# Altium project BOOSTXL-DRV8301.PrjPcb (part 1 of 2)
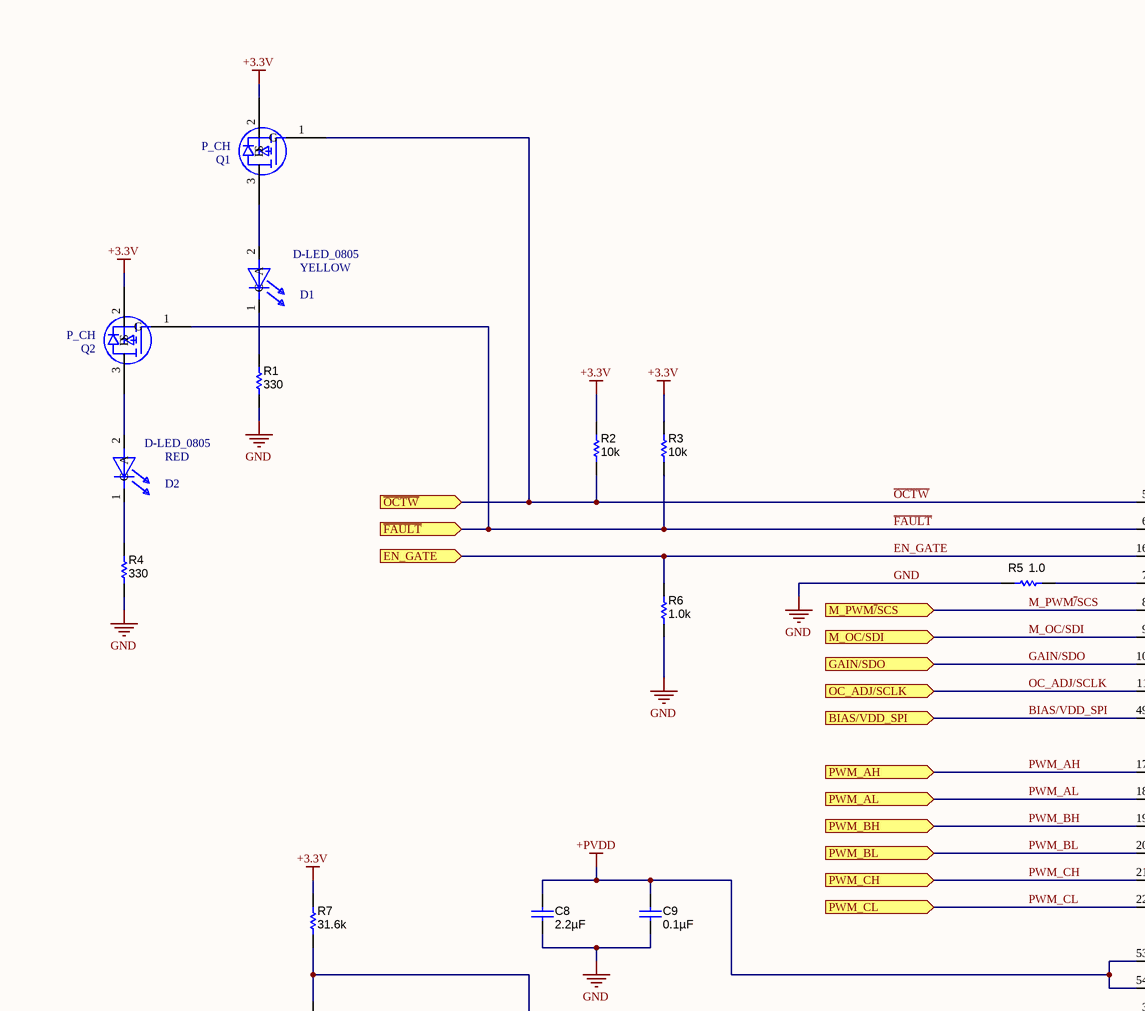
[diagram p0: DRV8301.SchDoc, top left]
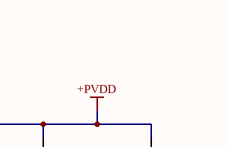
[diagram p1: DRV8301.SchDoc, top right]
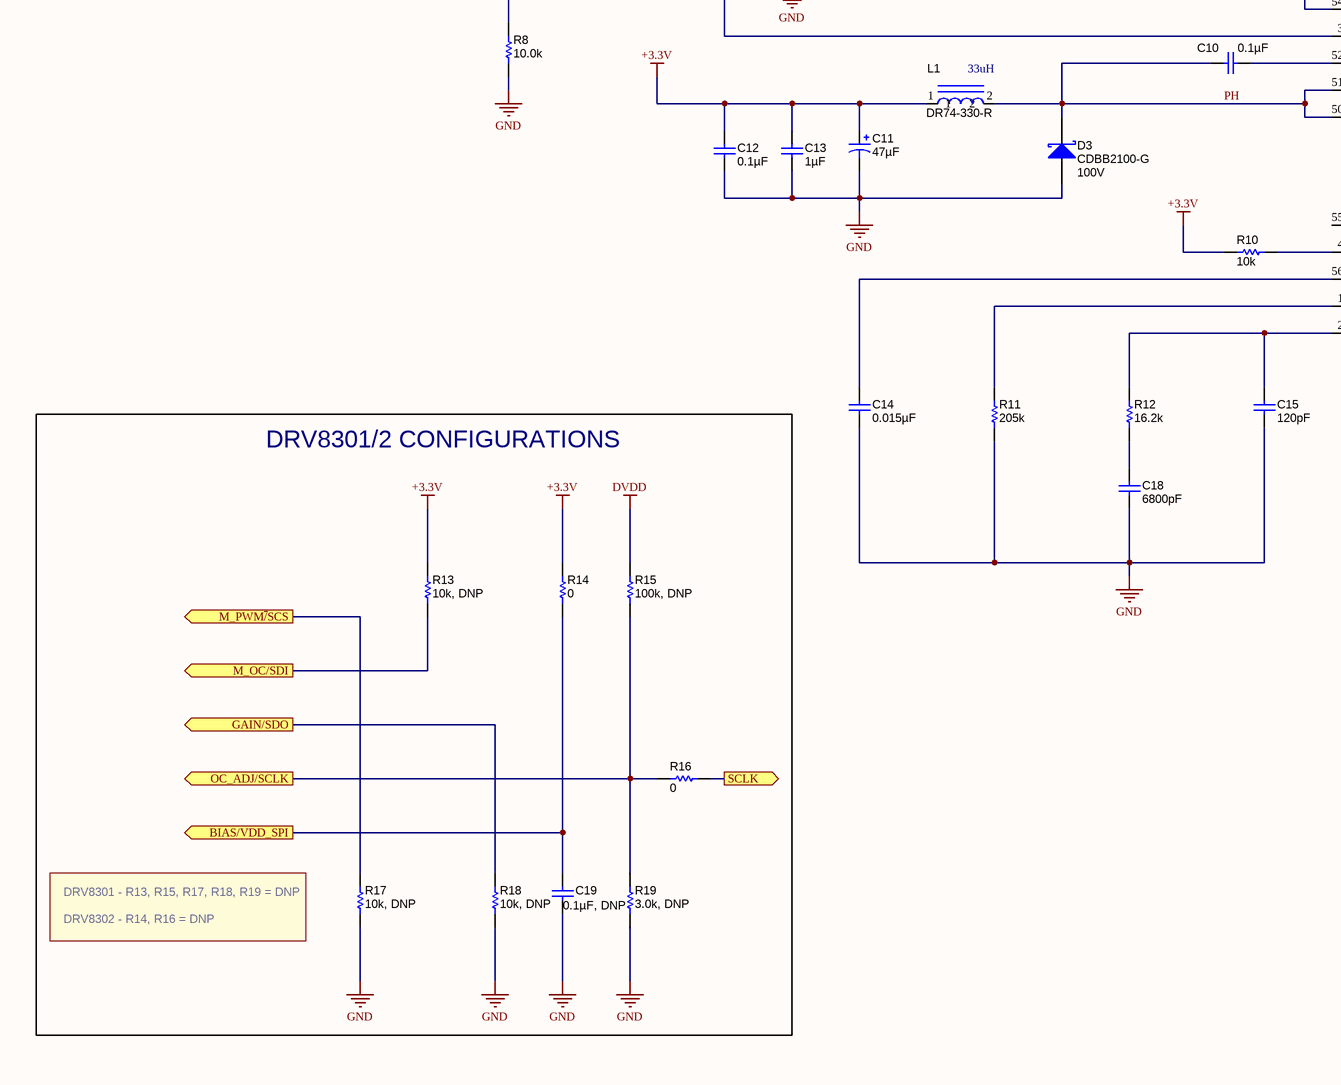
[diagram p2: DRV8301.SchDoc, bottom left]
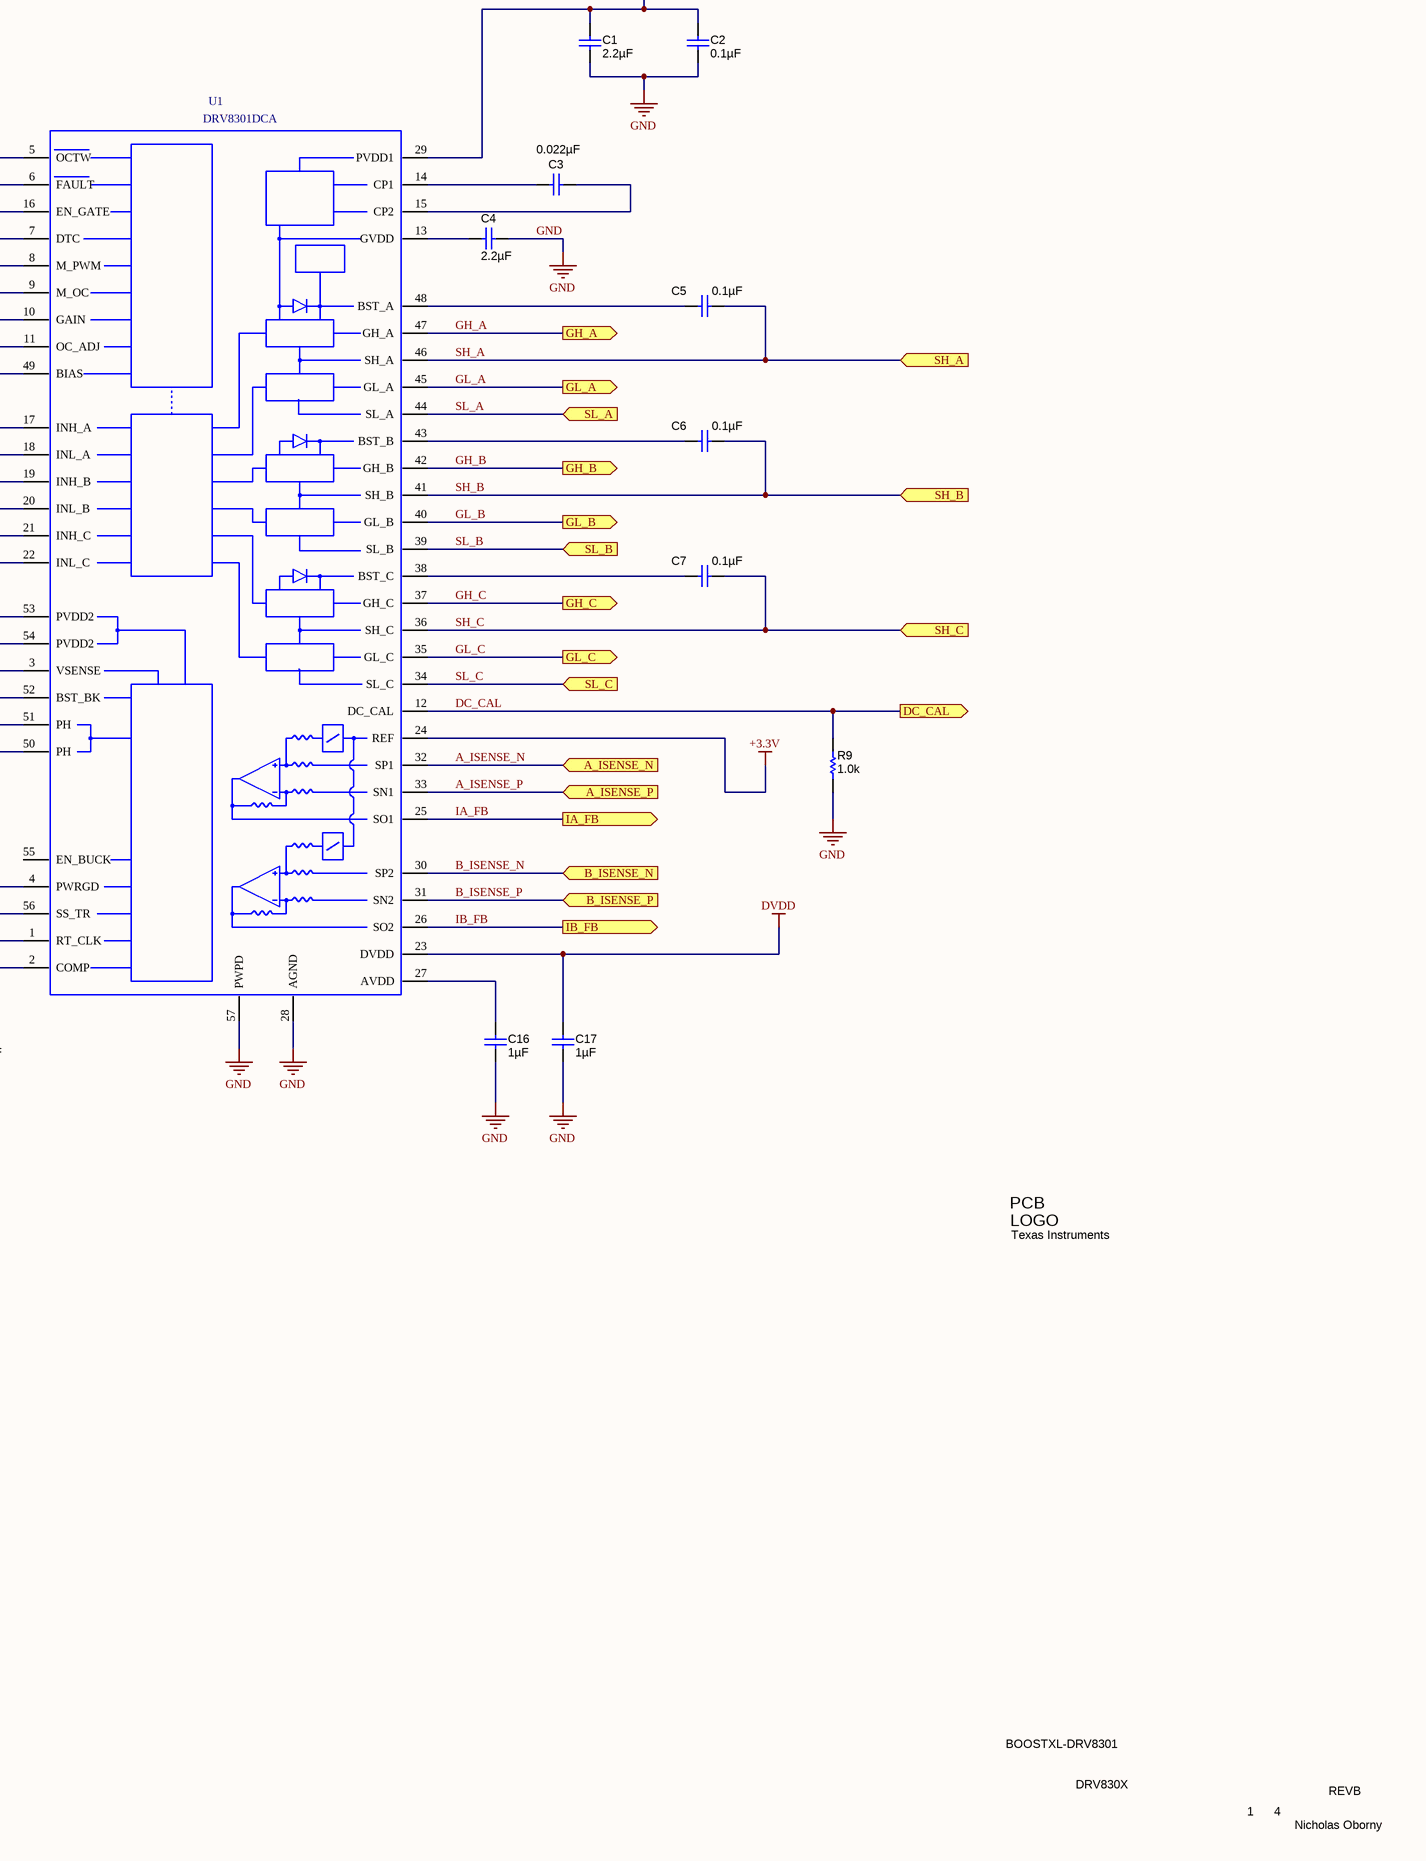
[diagram p3: DRV8301.SchDoc, bottom right]
4 sheets, 114 parts. Net scope: flat (ports and power ports of the same name join across sheets).
Board file: BOOSTXL-DRV8301.PcbDoc
Sheets:
  DRV8301.SchDoc
  LAUNCHPAD.SchDoc
  MOTOR.SchDoc
  SENSE.SchDoc

## Sheet DRV8301.SchDoc
size 558 x 431 mm; Engineer: Nicholas Oborny; Revision: A.1; Name: Nicholas Oborny; Start Date: 7/23/2012

### Parts
C1  ValueDisplayed: 2.2µF  [1210L]  (hidden comment: GRM32ER72A225KA35L)
C2  ValueDisplayed: 0.1µF  [0603L]  (hidden comment: GRM188R72A104KA35D)
C3  ValueDisplayed: 0.022µF  [0603L]  (hidden comment: C1608X7R1H223K)
C4  ValueDisplayed: 2.2µF  [0805L]  (hidden comment: GRM219R61E225KA12D)
C5  ValueDisplayed: 0.1µF  [0603L]  (hidden comment: C1608X7R1H104K)
C6  ValueDisplayed: 0.1µF  [0603L]  (hidden comment: C1608X7R1H104K)
C7  ValueDisplayed: 0.1µF  [0603L]  (hidden comment: C1608X7R1H104K)
C8  ValueDisplayed: 2.2µF  [1210L]  (hidden comment: GRM32ER72A225KA35L)
C9  ValueDisplayed: 0.1µF  [0603L]  (hidden comment: GRM188R72A104KA35D)
C10  ValueDisplayed: 0.1µF  [0603L]  (hidden comment: C1608X7R1H104K)
C11  ValueDisplayed: 47µF  [SM_RADIAL_D]  (hidden comment: EEE-FK1E470P)
C12  ValueDisplayed: 0.1µF  [0603L]  (hidden comment: C1608X7R1E104K)
C13  ValueDisplayed: 1µF  [0603L]  (hidden comment: C1608X5R1E105K080AC)
C14  ValueDisplayed: 0.015µF  [0603L]  (hidden comment: GRM188R71H153KA01D)
C15  ValueDisplayed: 120pF  [0603L]  (hidden comment: GRM1885C1H121JA01D)
C16  ValueDisplayed: 1µF  [0603L]  (hidden comment: GRM188R61E105KA12D)
C17  ValueDisplayed: 1µF  [0603L]  (hidden comment: GRM188R61E105KA12D)
C18  ValueDisplayed: 6800pF  [0603L]  (hidden comment: GRM188R71H682KA01D)
C19  ValueDisplayed: 0.1µF, DNP  [0603L]  (hidden comment: C1608X7R1E104K)
D1  D-LED_0805  value YELLOW  [LED_0805]
D2  D-LED_0805  value RED  [LED_0805]
D3  CDBB2100-G  value 100V  [SMB]
L1  DR74-330-R  value 33uH  [IND_DR74]
Logo1  Texas Instruments  [TI_Symbol_Overlay_Small]  (no BOM)
Q1  value P_CH  [SOT-23]  (hidden comment: TR_PFET_SOT23)
Q2  value P_CH  [SOT-23]  (hidden comment: TR_PFET_SOT23)
R1  value 330  [0603L]  (hidden comment: CRCW0603330RJNEA)
R2  value 10k  [0603L]  (hidden comment: CRCW060310K0JNEA)
R3  value 10k  [0603L]  (hidden comment: CRCW060310K0JNEA)
R4  value 330  [0603L]  (hidden comment: CRCW0603330RJNEA)
R5  value 1.0  [0603L]  (hidden comment: CRCW06031R00JNEA)
R6  value 1.0k  [0603L]  (hidden comment: CRCW06031K00JNEA)
R7  value 31.6k  [0603L]  (hidden comment: CRCW060331K6FKEA)
R8  value 10.0k  [0603L]  (hidden comment: RG1608P-103-B-T5)
R9  value 1.0k  [0603L]  (hidden comment: CRCW06031K00JNEA)
R10  value 10k  [0603L]  (hidden comment: CRCW060310K0JNEA)
R11  value 205k  [0603L]  (hidden comment: CRCW0603205KFKEA)
R12  value 16.2k  [0603L]  (hidden comment: CRCW060316K2FKEA)
R13  value 10k, DNP  [0603L]  (hidden comment: CRCW060310K0JNEA)
R14  value 0  [0603L]  (hidden comment: CRCW06030000Z0EA)
R15  value 100k, DNP  [0603L]  (hidden comment: CRCW0603100KJNEA)
R16  value 0  [0603L]  (hidden comment: CRCW06030000Z0EA)
R17  value 10k, DNP  [0603L]  (hidden comment: CRCW060310K0JNEA)
R18  value 10k, DNP  [0603L]  (hidden comment: CRCW060310K0JNEA)
R19  value 3.0k, DNP  [0603L]  (hidden comment: CRCW06033K00JNEA)
U1  DRV8301DCA  [DCA_56P]

### Blocks framed on the sheet
DRV8301/2 CONFIGURATIONS: C19 R13-R19

### Ports
A_ISENSE_N, A_ISENSE_P, B_ISENSE_N, B_ISENSE_P, BIAS/VDD_SPI, DC_CAL, EN_GATE, GAIN/SDO, GH_A, GH_B, GH_C, GL_A, GL_B, GL_C, IA_FB, IB_FB, M_OC/SDI, M_PWM~{/}SCS, OC_ADJ/SCLK, PWM_AH, PWM_AL, PWM_BH, PWM_BL, PWM_CH, PWM_CL, SCLK, SH_A, SH_B, SH_C, SL_A, SL_B, SL_C, ~{FAULT}, ~{OCTW}

### Nets
+3.3V: C11.1(+) C12.1 C13.1 L1.1 Q1.2(S) Q2.2(S) R2.2 R3.2 R7.2 R10.2 R13.2 R14.2 U1.24(REF)
+PVDD: C1.1 C2.1 C8.1 C9.1 U1.29(PVDD1) U1.53(PVDD2) U1.54(PVDD2)
DVDD: C17.1 R15.1 U1.23(DVDD)
GND: C1.2 C2.2 C4.2 C8.2 C9.2 C11.2(-) C12.2 C13.2 C14.2 C15.2 C16.2 C17.2 C18.2 C19.2 D3.2(A) R1.1 R4.1 R5.1 R6.1 R8.1 R9.1 R11.1 R17.1 R18.1 R19.1 U1.28(AGND) U1.57(PWPD)
~{FAULT}: Q2.1(G) R3.1 U1.6(FAULT) ; port ~{FAULT}
~{OCTW}: Q1.1(G) R2.1 U1.5(OCTW) ; port ~{OCTW}
A_ISENSE_N: U1.32(SP1) ; port A_ISENSE_N
A_ISENSE_P: U1.33(SN1) ; port A_ISENSE_P
B_ISENSE_N: U1.30(SP2) ; port B_ISENSE_N
B_ISENSE_P: U1.31(SN2) ; port B_ISENSE_P
BIAS/VDD_SPI: C19.1 R14.1 U1.49(BIAS) ; port BIAS/VDD_SPI
DC_CAL: R9.2 U1.12(DC_CAL) ; port DC_CAL
EN_GATE: R6.2 U1.16(EN_GATE) ; port EN_GATE
GAIN/SDO: R18.2 U1.10(GAIN) ; port GAIN/SDO
GH_A: U1.47(GH_A) ; port GH_A
GH_B: U1.42(GH_B) ; port GH_B
GH_C: U1.37(GH_C) ; port GH_C
GL_A: U1.45(GL_A) ; port GL_A
GL_B: U1.40(GL_B) ; port GL_B
GL_C: U1.35(GL_C) ; port GL_C
IA_FB: U1.25(SO1) ; port IA_FB
IB_FB: U1.26(SO2) ; port IB_FB
M_OC/SDI: R13.1 U1.9(M_OC) ; port M_OC/SDI
M_PWM~{/}SCS: R17.2 U1.8(M_PWM) ; port M_PWM~{/}SCS
OC_ADJ/SCLK: R15.2 R16.2 R19.2 U1.11(OC_ADJ) ; port OC_ADJ/SCLK
PH: C10.1 D3.1(K) L1.2 U1.50(PH) U1.51(PH)
PWM_AH: U1.17(INH_A) ; port PWM_AH
PWM_AL: U1.18(INL_A) ; port PWM_AL
PWM_BH: U1.19(INH_B) ; port PWM_BH
PWM_BL: U1.20(INL_B) ; port PWM_BL
PWM_CH: U1.21(INH_C) ; port PWM_CH
PWM_CL: U1.22(INL_C) ; port PWM_CL
SH_A: C5.2 U1.46(SH_A) ; port SH_A
SH_B: C6.2 U1.41(SH_B) ; port SH_B
SH_C: C7.2 U1.36(SH_C) ; port SH_C
SL_A: U1.44(SL_A) ; port SL_A
SL_B: U1.39(SL_B) ; port SL_B
SL_C: U1.34(SL_C) ; port SL_C
NetC3_1: C3.1 U1.14(CP1)
NetC3_2: C3.2 U1.15(CP2)
NetC4_1: C4.1 U1.13(GVDD)
NetC5_1: C5.1 U1.48(BST_A)
NetC6_1: C6.1 U1.43(BST_B)
NetC7_1: C7.1 U1.38(BST_C)
NetC10_2: C10.2 U1.52(BST_BK)
NetC14_1: C14.1 U1.56(SS_TR)
NetC15_1: C15.1 R12.2 U1.2(COMP)
NetC16_1: C16.1 U1.27(AVDD)
NetC18_1: C18.1 R12.1
NetD1_1: D1.1(C) R1.2
NetD1_2: D1.2(A) Q1.3(D)
NetD2_1: D2.1(C) R4.2
NetD2_2: D2.2(A) Q2.3(D)
NetJ3_14: R16.1 ; port SCLK
NetR5_2: R5.2 U1.7(DTC)
NetR7_1: R7.1 R8.2 U1.3(VSENSE)
NetR10_1: R10.1 U1.4(PWRGD)
NetR11_2: R11.2 U1.1(RT_CLK)

Not connected (* = marked no-connect by the designer): U1 55(EN_BUCK)

### Notes on the sheet
- DRV8301 - R13, R15, R17, R18, R19 = DNP
- DRV8302 - R14, R16 = DNP
- BOOSTXL-DRV8301
- DRV830X
- 1
- 4
- REVB
- Nicholas Oborny
- (in symbol TI_Logo) PCB; LOGO

### Library data of the parts
C1 C8 = GRM32ER72A225KA35L: CAP, CERM, 2.2uF, 100V, +/-10%, X7R, 1210; Manufacturer: MuRata; Polarized: N; CompType: Capacitor; U/M: EA; Cap_F: 0.0000022; Tolerance_%: 10; ESR_Ohm: 0.007; Value1: 0.007 ohm; VDC_V: 100; IRMS_A: 4.4; TaMin_C: -55; TaMax_C: 125; Cap_Case: 1210; SymbolVersion: 2008-07-09; Value: 2.2uF; PartNumber: GRM32ER72A225KA35L; PackageReference: 1210; RoHS: Y; Value2: 100V; MountType: SMT; Technology: Ceramic; TempCo: X7R; Published: 2008-06-19; Publisher: Texas Instruments; LatestRevisionDate: 2013-05-24; LatestRevisionNote: Changed publisher; ComponentLink1Description: Datasheet link; ComponentLink1URL: http://search.murata.co.jp/Ceramy/PnsearchViewAction.do?HnOFG=ON&HnNFG=ON&SEL_CNT=50&sLang=en&sKey=GRM32ER72A225KA35L&x=9&y=9&search=startwith; Supplier 1: Digi-Key; Supplier Part Number 1: 490-3385-1-ND; Supplier 2: Mouser; Supplier Part Number 2: 81-GRM32ER72A225KA35; Supplier 3: Farnell; Supplier Part Number 3: 1735547
C2 C9 = GRM188R72A104KA35D: CAP, CERM, 0.1uF, 100V, +/-10%, X7R, 0603; Manufacturer: MuRata; Polarized: N; CompType: Capacitor; U/M: EA; Cap_F: 0.0000001; Tolerance_%: 10; Value1: Unknown; VDC_V: 100; TaMin_C: -55; TaMax_C: 125; Cap_Case: 0603; SymbolVersion: 2008-07-09; Value: 0.1uF; PartNumber: GRM188R72A104KA35D; PackageReference: 0603; RoHS: Y; Value2: 100V; MountType: SMT; Technology: Ceramic; TempCo: X7R; Published: 2008-06-19; Publisher: Texas Instruments; LatestRevisionDate: 2013-05-24; LatestRevisionNote: Changed publisher; ComponentLink1Description: Datasheet link; ComponentLink1URL: http://search.murata.co.jp/Ceramy/PnsearchViewAction.do?HnOFG=ON&HnNFG=ON&SEL_CNT=50&sLang=en&sKey=GRM188R72A104KA35D&x=9&y=9&search=startwith; Supplier 1: Digi-Key; Supplier Part Number 1: 490-3285-1-ND; Supplier 2: Mouser; Supplier Part Number 2: 81-GRM188R72A104KA35; Supplier 3: Farnell; Supplier Part Number 3: 1828921
C3 = C1608X7R1H223K: CAP, CERM, 0.022uF, 50V, +/-10%, X7R, 0603; Manufacturer: TDK; Polarized: N; CompType: Capacitor; U/M: EA; Cap_F: 0.000000022; Tolerance_%: 10; ESR_Ohm: 0.0383; Value1: 0.0383 ohm; VDC_V: 50; TaMin_C: -55; TaMax_C: 125; Cap_Case: 0603; SymbolVersion: 2008-07-09; Value: 0.022uF; PartNumber: C1608X7R1H223K; PackageReference: 0603; RoHS: Y; Value2: 50V; MountType: SMT; Technology: Ceramic; TempCo: X7R; Published: 2008-06-19; Publisher: Texas Instruments; LatestRevisionDate: 2013-05-24; LatestRevisionNote: Changed publisher; ComponentLink1Description: Datasheet link; ComponentLink1URL: http://www.tdk.co.jp/tefe02/e412_c.pdf; Supplier 1: Digi-Key; Supplier Part Number 1: 445-1312-1-ND; Supplier 2: Farnell; Supplier Part Number 2: 1907316
C4 = GRM219R61E225KA12D: CAP, CERM, 2.2uF, 25V, +/-10%, X5R, 0805; Manufacturer: MuRata; Polarized: N; CompType: Capacitor; U/M: EA; Cap_F: 0.0000022; Tolerance_%: 10; ESR_Ohm: 0.006; Value1: 0.006 ohm; VDC_V: 25; TaMin_C: -55; TaMax_C: 85; Cap_Case: 0805; SymbolVersion: 2008-07-09; Value: 2.2uF; PartNumber: GRM219R61E225KA12D; PackageReference: 0805; RoHS: Y; Value2: 25V; MountType: SMT; Technology: Ceramic; TempCo: X5R; Published: 2008-06-19; Publisher: Texas Instruments; LatestRevisionDate: 2013-05-24; LatestRevisionNote: Changed publisher; ComponentLink1Description: Datasheet link; ComponentLink1URL: http://search.murata.co.jp/Ceramy/PnsearchViewAction.do?HnOFG=ON&HnNFG=ON&SEL_CNT=50&sLang=en&sKey=GRM219R61E225KA12D&x=9&y=9&search=startwith; Supplier 1: Digi-Key; Supplier Part Number 1: 490-1701-1-ND; Supplier 2: Mouser; Supplier Part Number 2: 81-GRM219R61E225K; Supplier 3: Farnell; Supplier Part Number 3: 1845749
C5-C7 C10 = C1608X7R1H104K: CAP, CERM, 0.1uF, 50V, +/-10%, X7R, 0603; Manufacturer: TDK; Polarized: N; CompType: Capacitor; U/M: EA; Cap_F: 0.0000001; Tolerance_%: 10; ESR_Ohm: 0.017; Value1: 0.017 ohm; VDC_V: 50; TaMin_C: -55; TaMax_C: 125; Cap_Case: 0603; SymbolVersion: 2008-07-09; Value: 0.1uF; PartNumber: C1608X7R1H104K; PackageReference: 0603; RoHS: Y; Value2: 50V; MountType: SMT; Technology: Ceramic; TempCo: X7R; Published: 2008-06-19; Publisher: Texas Instruments; LatestRevisionDate: 2013-05-24; LatestRevisionNote: Changed publisher; ComponentLink1Description: Datasheet link; ComponentLink1URL: http://www.tdk.co.jp/tefe02/e412_c.pdf; Supplier 1: Digi-Key; Supplier Part Number 1: 445-1314-1-ND; Supplier 2: Farnell; Supplier Part Number 2: 1118182
C11 = EEE-FK1E470P: CAP, AL, 47uF, 25V, +/-20%, 0.36 ohm, SMD; Manufacturer: Panasonic; Polarized: Y; CompType: Capacitor; U/M: EA; Cap_F: 0.000047; Tolerance_%: 20; VDC_V: 25; ESR_Ohm: 0.36; IRMS_A: 0.24; TaMin_C: -55; TaMax_C: 105; Cap_Case: D; SymbolVersion: 2008-07-09; Value: 47uF; PartNumber: EEE-FK1E470P; PackageReference: SMT Radial D; RoHS: Y; Value1: 0.36 ohm; Value2: 25V; MountType: SMT; Technology: AL; Series: FK; Publisher: Texas Instruments; LatestRevisionDate: 2013-05-31; ComponentLink1Description: Datasheet link; ComponentLink1URL: http://www.panasonic.com/industrial/components/pdf/smt_aec_050505.pdf; Supplier 1: Digi-Key; Supplier Part Number 1: PCE3804CT-ND; Supplier 2: Mouser; Supplier Part Number 2: 667-EEE-FK1E470P; Supplier 3: Farnell; Supplier Part Number 3: 9695753
C12 C19 = C1608X7R1E104K: CAP, CERM, 0.1uF, 25V, +/-10%, X7R, 0603; Manufacturer: TDK; Polarized: N; CompType: Capacitor; U/M: EA; Cap_F: 0.0000001; Tolerance_%: 10; ESR_Ohm: 0.017; Value1: 0.017 ohm; VDC_V: 25; TaMin_C: -55; TaMax_C: 125; Cap_Case: 0603; SymbolVersion: 2008-07-09; Value: 0.1uF; PartNumber: C1608X7R1E104K; PackageReference: 0603; RoHS: Y; Value2: 25V; MountType: SMT; Technology: Ceramic; TempCo: X7R; Published: 2008-06-19; Publisher: Texas Instruments; LatestRevisionDate: 2013-05-24; LatestRevisionNote: Changed publisher; ComponentLink1Description: Datasheet link; ComponentLink1URL: http://www.tdk.co.jp/tefe02/e412_c.pdf; Supplier 1: Digi-Key; Supplier Part Number 1: 445-1316-1-ND; Supplier 2: Farnell; Supplier Part Number 2: 1844230
C13 = C1608X5R1E105K080AC: CAP, CERM, 1uF, 25V, +/-10%, X5R, 0603; Manufacturer: TDK; Polarized: N; CompType: Capacitor; U/M: EA; Cap_F: 0.000001; Tolerance_%: 10; Value1: Unknown; VDC_V: 25; TaMin_C: -55; TaMax_C: 85; Cap_Case: 0603; SymbolVersion: 2008-07-09; Value: 1uF; PartNumber: C1608X5R1E105K080AC; PackageReference: 0603; RoHS: Y; Value2: 25V; MountType: SMT; Technology: Ceramic; TempCo: X5R; Published: 2008-06-19; Publisher: Texas Instruments; LatestRevisionDate: 2013-05-24; LatestRevisionNote: Changed publisher; ComponentLink1Description: Datasheet link; ComponentLink1URL: http://product.tdk.com/capacitor/mlcc/en/documents/mlcc_commercial_general_en.pdf; Supplier 1: Digi-Key; Supplier Part Number 1: 445-5146-1-ND; Supplier 2: Newark; Supplier Part Number 2: 90R7677
C14 = GRM188R71H153KA01D: CAP, CERM, 0.015uF, 50V, +/-10%, X7R, 0603; Manufacturer: MuRata; Polarized: N; CompType: Capacitor; U/M: EA; Cap_F: 0.000000015; Tolerance_%: 10; Value1: Unknown; VDC_V: 50; TaMin_C: -55; TaMax_C: 125; Cap_Case: 0603; SymbolVersion: 2008-07-09; Value: 0.015uF; PartNumber: GRM188R71H153KA01D; PackageReference: 0603; RoHS: Y; Value2: 50V; MountType: SMT; Technology: Ceramic; TempCo: X7R; Published: 2008-06-19; Publisher: Texas Instruments; LatestRevisionDate: 2013-05-24; LatestRevisionNote: Changed publisher; ComponentLink1Description: Datasheet link; ComponentLink1URL: http://search.murata.co.jp/Ceramy/PnsearchViewAction.do?HnOFG=ON&HnNFG=ON&SEL_CNT=50&sLang=en&sKey=GRM188R71H153KA01D&x=9&y=9&search=startwith; Supplier 1: Digi-Key; Supplier Part Number 1: 490-1514-1-ND; Supplier 2: Mouser; Supplier Part Number 2: 81-GRM18R71H153KA01D; Supplier 3: Farnell; Supplier Part Number 3: 1828916
C15 = GRM1885C1H121JA01D: CAP, CERM, 120pF, 50V, +/-5%, C0G/NP0, 0603; Manufacturer: MuRata; Polarized: N; CompType: Capacitor; U/M: EA; Cap_F: 0.00000000012; Tolerance_%: 5; Value1: Unknown; VDC_V: 50; TaMin_C: -55; TaMax_C: 125; Cap_Case: 0603; SymbolVersion: 2008-07-09; Value: 120pF; PartNumber: GRM1885C1H121JA01D; PackageReference: 0603; RoHS: Y; Value2: 50V; MountType: SMT; Technology: Ceramic; TempCo: C0G/NP0; Published: 2008-06-19; Publisher: Texas Instruments; LatestRevisionDate: 2013-05-24; LatestRevisionNote: Changed publisher; ComponentLink1Description: Datasheet link; ComponentLink1URL: http://search.murata.co.jp/Ceramy/PnsearchViewAction.do?HnOFG=ON&HnNFG=ON&SEL_CNT=50&sLang=en&sKey=GRM1885C1H121JA01D&x=9&y=9&search=startwith; Supplier 1: Digi-Key; Supplier Part Number 1: 490-1429-1-ND; Supplier 2: Mouser; Supplier Part Number 2: 81-GRM39C121J50; Supplier 3: Farnell; Supplier Part Number 3: 1403555
C16 C17 = GRM188R61E105KA12D: CAP, CERM, 1uF, 25V, +/-10%, X5R, 0603; Manufacturer: MuRata; Polarized: N; CompType: Capacitor; U/M: EA; Cap_F: 0.000001; Tolerance_%: 10; Value1: Unknown; VDC_V: 25; TaMin_C: -55; TaMax_C: 85; Cap_Case: 0603; SymbolVersion: 2008-07-09; Value: 1uF; PartNumber: GRM188R61E105KA12D; PackageReference: 0603; RoHS: Y; Value2: 25V; MountType: SMT; Technology: Ceramic; TempCo: X5R; Published: 2008-06-19; Publisher: Texas Instruments; LatestRevisionDate: 2013-05-24; LatestRevisionNote: Changed publisher; ComponentLink1Description: Datasheet link; ComponentLink1URL: http://search.murata.co.jp/Ceramy/PnsearchViewAction.do?HnOFG=ON&HnNFG=ON&SEL_CNT=50&sLang=en&sKey=GRM188R61E105KA12D&x=9&y=9&search=startwith; Supplier 1: Digi-Key; Supplier Part Number 1: 490-3897-1-ND; Supplier 2: Mouser; Supplier Part Number 2: 81-GRM188R61E105KA12; Supplier 3: Farnell; Supplier Part Number 3: 1828802
C18 = GRM188R71H682KA01D: CAP, CERM, 6800pF, 50V, +/-10%, X7R, 0603; Manufacturer: MuRata; Polarized: N; CompType: Capacitor; U/M: EA; Cap_F: 0.0000000068; Tolerance_%: 10; Value1: Unknown; VDC_V: 50; TaMin_C: -55; TaMax_C: 125; Cap_Case: 0603; SymbolVersion: 2008-07-09; Value: 6800pF; PartNumber: GRM188R71H682KA01D; PackageReference: 0603; RoHS: Y; Value2: 50V; MountType: SMT; Technology: Ceramic; TempCo: X7R; Published: 2008-06-19; Publisher: Texas Instruments; LatestRevisionDate: 2013-05-24; LatestRevisionNote: Changed publisher; ComponentLink1Description: Datasheet link; ComponentLink1URL: http://search.murata.co.jp/Ceramy/PnsearchViewAction.do?HnOFG=ON&HnNFG=ON&SEL_CNT=50&sLang=en&sKey=GRM188R71H682KA01D&x=9&y=9&search=startwith; Supplier 1: Digi-Key; Supplier Part Number 1: 490-1508-1-ND; Supplier 2: Mouser; Supplier Part Number 2: 81-GRM39X682K50D; Supplier 3: Farnell; Supplier Part Number 3: 1403792
D1 = D-LED_0805: LED THIN 585NM YEL DIFF 0805 SMD; PartNumber: SML-LXT0805YW-TR; Manufacturer: Lumex Opto/Components Inc; Vendor Part #: 67-1554-1-ND; PCB DECAL: LED-0805DA; Vendor: DigiKey; ModifyDate: 10/26/2011 10:26:35; ComponentHeight: 0.80 mm; Size: 805
D2 = D-LED_0805: LED THIN660NM SUPRED DIFF0805SMD; PartNumber: SML-LXT0805SRW-TR; Manufacturer: Lumex Opto/Components Inc; Vendor Part #: 67-1555-1-ND; Vendor: DigiKey; ModifyDate: 10/26/2011 10:26:35; PCB DECAL: LED-0805; ComponentHeight: 0.80 mm; Size: 805
D3 = CDBC5100-G: Diode, Schottky, 100V, 2A, SMB; Manufacturer: Comchip Technology; U/M: EA; Vf_V: 0.85; Value2: 0.85V; Io_A: 2; Vr_V: 100; TJmax_C: 125; CompType: Diode; SymbolVersion: 2008-12-08; PartNumber: CDBB2100-G; PackageReference: SMB; Value1: 2A; MountType: SMT; Type: Schottky; RoHS: Y; Published: 2008-06-26; Publisher: Texas Instruments; LatestRevisionDate: 2013-06-04; ComponentLink1Description: Datasheet link; ComponentLink1URL: http://www.comchiptech.com/cms/UserFiles/CDBB220-G%20Thru935254.%20CDBB2100-G%20RevB.pdf; Supplier 1: Digi-Key; Supplier Part Number 1: 641-1109-1-ND; Supplier 2: Mouser; Supplier Part Number 2: 750-CDBB2100-G
L1 = IND_DR74-XXX: INDUCTOR SHIELD PWR 33UH SMD; Manufacturer: Cooper Bussmann; Area: 122500; ComponentLink1URL: \\vette02\pmp_pcb\pcad_pdf's\DR series inductor.pdf; ComponentHeight: 0.175; PackageReference: 0.300" sq; SymbolVersion: 07/31/2009 12:17:29; PartNumber: DR74-330-R; ComponentLink1Description: AEO Datasheet Link
Logo1 = TI_Logo: Texas Instrument Corporate Signature; SymbolCreator: codlsc; SymbolVersion: 2011-08-22; ClassName: Logo; Published: 2009-03-03; Publisher: Texas Instruments; LatestRevisionDate: 2012-05-17; LatestRevisionNote: Changed publisher
Q1 Q2 = TR_PFET_SOT23: MOSFET P-CH 8V 5.4A SOT23-3; PartNumber: SI2325DS-T1-E3; Manufacturer: Vishey Siliconix; Vendor Part #: S12325DS-T1-E3CT-ND; Vendor: DigiKey; ModifyDate: 11/01/2006 14:12:04; ComponentHeight: 0.043 inch; PCB DECAL: SOT-23; Size: SOT-23
R1 R4 = CRCW0603330RJNEA: RES, 330 ohm, 5%, 0.1W, 0603; Manufacturer: Vishay-Dale; CompType: Resistor; Value_Code: 330R; Tolerance_%: 5; Power_W: 0.1; VDC_V: 75; TempCo: 200 ppm/C; EIA_Code: E24; U/M: EA; SymbolVersion: 2009-05-29; PartNumber: CRCW0603330RJNEA; PackageReference: 0603; RoHS: Y; Res_ohm: 330; Value1: 5%; Value2: 0.1W; MountType: SMT; Technology: Thick Film; Published: 2008-06-26; Publisher: Texas Instruments; LatestRevisionDate: 2013-01-08; ComponentLink1Description: Datasheet link; ComponentLink1URL: http://www.vishay.com/docs/20035/dcrcwe3.pdf; Supplier 1: Digi-Key; Supplier Part Number 1: 541-330GCT-ND; Supplier 2: Mouser; Supplier Part Number 2: 71-CRCW0603J-330-E3; Supplier 3: Farnell; Supplier Part Number 3: 1692522
R2 R3 R10 = CRCW060310K0JNEA: RES, 10k ohm, 5%, 0.1W, 0603; Manufacturer: Vishay-Dale; CompType: Resistor; Res_ohm: 10000; Value_Code: 10k0; Tolerance_%: 5; Power_W: 0.1; VDC_V: 75; TempCo: 200 ppm/C; EIA_Code: E24; U/M: EA; SymbolVersion: 2009-05-29; PartNumber: CRCW060310K0JNEA; PackageReference: 0603; RoHS: Y; Value1: 5%; Value2: 0.1W; MountType: SMT; Technology: Thick Film; Published: 2008-06-26; Publisher: Texas Instruments; LatestRevisionDate: 2013-01-08; ComponentLink1Description: Datasheet link; ComponentLink1URL: http://www.vishay.com/docs/20035/dcrcwe3.pdf; Supplier 1: Digi-Key; Supplier Part Number 1: 541-10KGCT-ND; Supplier 2: Farnell; Supplier Part Number 2: 1562240; Supplier 3: Newark; Supplier Part Number 3: 52K8066
R5 = CRCW06031R00JNEA: RES, 1.0 ohm, 5%, 0.1W, 0603; Manufacturer: Vishay-Dale; CompType: Resistor; Res_ohm: 1; Value_Code: 1R00; Tolerance_%: 5; Power_W: 0.1; VDC_V: 75; TempCo: 200 ppm/C; EIA_Code: E24; U/M: EA; SymbolVersion: 2009-05-29; PartNumber: CRCW06031R00JNEA; PackageReference: 0603; RoHS: Y; Value1: 5%; Value2: 0.1W; MountType: SMT; Technology: Thick Film; Published: 2008-06-26; Publisher: Texas Instruments; LatestRevisionDate: 2013-01-08; ComponentLink1Description: Datasheet link; ComponentLink1URL: http://www.vishay.com/docs/20035/dcrcwe3.pdf; Supplier 1: Digi-Key; Supplier Part Number 1: 541-1.0GCT-ND; Supplier 2: Mouser; Supplier Part Number 2: 71-CRCW0603J-1-E3; Supplier 3: Farnell; Supplier Part Number 3: 1514709
R6 R9 = CRCW06031K00JNEA: RES, 1.0k ohm, 5%, 0.1W, 0603; Manufacturer: Vishay-Dale; CompType: Resistor; Res_ohm: 1000; Value_Code: 1k00; Tolerance_%: 5; Power_W: 0.1; VDC_V: 75; TempCo: 200 ppm/C; EIA_Code: E24; U/M: EA; SymbolVersion: 2009-05-29; PartNumber: CRCW06031K00JNEA; PackageReference: 0603; RoHS: Y; Value1: 5%; Value2: 0.1W; MountType: SMT; Technology: Thick Film; Published: 2008-06-26; Publisher: Texas Instruments; LatestRevisionDate: 2013-01-08; ComponentLink1Description: Datasheet link; ComponentLink1URL: http://www.vishay.com/docs/20035/dcrcwe3.pdf; Supplier 1: Digi-Key; Supplier Part Number 1: 541-1.0KGCT-ND; Supplier 2: Farnell; Supplier Part Number 2: 1652851; Supplier 3: Newark; Supplier Part Number 3: 59M6750
R7 = CRCW060331K6FKEA: RES, 31.6k ohm, 1%, 0.1W, 0603; Manufacturer: Vishay-Dale; CompType: Resistor; Res_ohm: 31600; Value_Code: 31k6; Tolerance_%: 1; Power_W: 0.1; VDC_V: 75; TempCo: 100 ppm/C; EIA_Code: E96; U/M: EA; SymbolVersion: 2009-05-29; PartNumber: CRCW060331K6FKEA; PackageReference: 0603; RoHS: Y; Value1: 1%; Value2: 0.1W; MountType: SMT; Technology: Thick Film; Published: 2008-06-26; Publisher: Texas Instruments; LatestRevisionDate: 2013-01-08; ComponentLink1Description: Datasheet link; ComponentLink1URL: http://www.vishay.com/docs/20035/dcrcwe3.pdf; Supplier 1: Digi-Key; Supplier Part Number 1: 541-31.6KHCT-ND; Supplier 2: Mouser; Supplier Part Number 2: 71-CRCW0603-31.6K-E3; Supplier 3: Farnell; Supplier Part Number 3: 1151933
R8 = RG1608P-103-B-T5: RES, 10.0k ohm, 0.1%, 0.1W, 0603; Manufacturer: Susumu Co Ltd; CompType: Resistor; Res_ohm: 10000; Value_Code: 10k0; Tolerance_%: 0.1; VDC_V: 75; TempCo: 25 ppm/C; EIA_Code: E192; U/M: EA; SymbolVersion: 2009-05-29; PartNumber: RG1608P-103-B-T5; PackageReference: 0603; RoHS: Y; Value1: 0.1%; Power_W: 0.1; Value2: 0.1W; MountType: SMT; Technology: Metal Film; Published: 2008-06-26; Publisher: Texas Instruments; LatestRevisionDate: 2013-01-08; ComponentLink1Description: Datasheet link; ComponentLink1URL: http://www.susumu.co.jp/english/pdf/products-j01-01.pdf; Supplier 1: Digi-Key; Supplier Part Number 1: RG16P10.0KBCT-ND; Supplier 2: Mouser; Supplier Part Number 2: 754-RG1608P-103-B-T5; Supplier 3: Farnell; Supplier Part Number 3: 1797079
R11 = CRCW0603205KFKEA: RES, 205k ohm, 1%, 0.1W, 0603; Manufacturer: Vishay-Dale; CompType: Resistor; Res_ohm: 205000; Tolerance_%: 1; Power_W: 0.1; VDC_V: 75; TempCo: 100 ppm/C; EIA_Code: E96; U/M: EA; SymbolVersion: 2009-05-29; PartNumber: CRCW0603205KFKEA; PackageReference: 0603; RoHS: Y; Value_Code: 205k; Value1: 1%; Value2: 0.1W; MountType: SMT; Technology: Thick Film; Published: 2008-06-26; Publisher: Texas Instruments; LatestRevisionDate: 2013-01-08; ComponentLink1Description: Datasheet link; ComponentLink1URL: http://www.vishay.com/docs/20035/dcrcwe3.pdf; Supplier 1: Digi-Key; Supplier Part Number 1: 541-205KHCT-ND; Supplier 2: Mouser; Supplier Part Number 2: 71-CRCW0603-205K-E3; Supplier 3: Farnell; Supplier Part Number 3: 1151818
R12 = CRCW060316K2FKEA: RES, 16.2k ohm, 1%, 0.1W, 0603; Manufacturer: Vishay-Dale; CompType: Resistor; Res_ohm: 16200; Value_Code: 16k2; Tolerance_%: 1; Power_W: 0.1; VDC_V: 75; TempCo: 100 ppm/C; EIA_Code: E96; U/M: EA; SymbolVersion: 2009-05-29; PartNumber: CRCW060316K2FKEA; PackageReference: 0603; RoHS: Y; Value1: 1%; Value2: 0.1W; MountType: SMT; Technology: Thick Film; Published: 2008-06-26; Publisher: Texas Instruments; LatestRevisionDate: 2013-01-08; ComponentLink1Description: Datasheet link; ComponentLink1URL: http://www.vishay.com/docs/20035/dcrcwe3.pdf; Supplier 1: Digi-Key; Supplier Part Number 1: 541-16.2KHCT-ND; Supplier 2: Mouser; Supplier Part Number 2: 71-CRCW0603-16.2K-E3; Supplier 3: Farnell; Supplier Part Number 3: 1151719
R13 R17 R18 = CRCW060310K0JNEA: RES, 10k ohm, 5%, 0.1W, 0603; Manufacturer: Vishay-Dale; Alternate Manufacturer: DNP; CompType: Resistor; Res_ohm: 10000; Value_Code: 10k0; Tolerance_%: 5; Power_W: 0.1; VDC_V: 75; TempCo: 200 ppm/C; EIA_Code: E24; U/M: EA; SymbolVersion: 2009-05-29; PartNumber: CRCW060310K0JNEA; PackageReference: 0603; RoHS: Y; Value1: 5%; Value2: 0.1W; MountType: SMT; Technology: Thick Film; Published: 2008-06-26; Publisher: Texas Instruments; LatestRevisionDate: 2013-01-08; ComponentLink1Description: Datasheet link; ComponentLink1URL: http://www.vishay.com/docs/20035/dcrcwe3.pdf; Alternate PartNumber: DNP; Supplier 1: Digi-Key; Supplier Part Number 1: 541-10KGCT-ND; Supplier 2: Farnell; Supplier Part Number 2: 1562240; Supplier 3: Newark; Supplier Part Number 3: 52K8066
R14 R16 = CRCW06030000Z0EA: RES, 0 ohm, 5%, 0.1W, 0603; Manufacturer: Vishay-Dale; CompType: Resistor; Value_Code: 0000; Tolerance_%: 5; Power_W: 0.1; VDC_V: 75; TempCo: 200 ppm/C; EIA_Code: E24; U/M: EA; SymbolVersion: 2009-05-29; PartNumber: CRCW06030000Z0EA; PackageReference: 0603; RoHS: Y; Res_ohm: 0; Value1: 5%; Value2: 0.1W; MountType: SMT; Technology: Thick Film; Published: 2008-06-26; Publisher: Texas Instruments; LatestRevisionDate: 2013-01-08; ComponentLink1Description: Datasheet link; ComponentLink1URL: http://www.vishay.com/docs/20035/dcrcwe3.pdf; Supplier 1: Digi-Key; Supplier Part Number 1: 541-0.0GCT-ND; Supplier 2: Mouser; Supplier Part Number 2: 71-CRCW0603-0-E3; Supplier 3: Farnell; Supplier Part Number 3: 1469739
R15 = CRCW0603100KJNEA: RES, 100k ohm, 5%, 0.1W, 0603; Manufacturer: Vishay-Dale; Alternate Manufacturer: DNP; CompType: Resistor; Res_ohm: 100000; Tolerance_%: 5; Power_W: 0.1; VDC_V: 75; TempCo: 200 ppm/C; EIA_Code: E24; U/M: EA; SymbolVersion: 2009-05-29; PartNumber: CRCW0603100KJNEA; PackageReference: 0603; RoHS: Y; Value_Code: 100k; Value1: 5%; Value2: 0.1W; MountType: SMT; Technology: Thick Film; Published: 2008-06-26; Publisher: Texas Instruments; LatestRevisionDate: 2013-01-08; ComponentLink1Description: Datasheet link; ComponentLink1URL: http://www.vishay.com/docs/20035/dcrcwe3.pdf; Alternate PartNumber: DNP; Supplier 1: Mouser; Supplier Part Number 1: 71-CRCW0603J-100K-E3; Supplier 2: Farnell; Supplier Part Number 2: 1692517; Supplier 3: Newark; Supplier Part Number 3: 59M6763
R19 = CRCW06033K00JNEA: RES, 3.0k ohm, 5%, 0.1W, 0603; Manufacturer: Vishay-Dale; Alternate Manufacturer: DNP; CompType: Resistor; Res_ohm: 3000; Value_Code: 3k00; Tolerance_%: 5; Power_W: 0.1; VDC_V: 75; TempCo: 200 ppm/C; EIA_Code: E24; U/M: EA; SymbolVersion: 2009-05-29; PartNumber: CRCW06033K00JNEA; PackageReference: 0603; RoHS: Y; Value1: 5%; Value2: 0.1W; MountType: SMT; Technology: Thick Film; Published: 2008-06-26; Publisher: Texas Instruments; LatestRevisionDate: 2013-01-08; ComponentLink1Description: Datasheet link; ComponentLink1URL: http://www.vishay.com/docs/20035/dcrcwe3.pdf; Alternate PartNumber: DNP; Supplier 1: Mouser; Supplier Part Number 1: 71-CRCW0603J-3.0K-E3; Supplier 2: Farnell; Supplier Part Number 2: 1563613; Supplier 3: Newark; Supplier Part Number 3: 72M6833
U1 = DRV8302DCA_ERIC: IC, 3 Phase Pre-Driver with Dual Current Shunt Amplifiers and Buck Regulator-Hardware Controlled; Manufacturer: Texas Instruments; Area: 154.44 mm; Vendor: Supplied; Value: DRV8301DCA; ModifyDate: 05/02/2012 07:50:13; PartNumber: DRV8301DCA; Size: HTSSOP; PCB DECAL: DCA_56P; Vendor Part #: Supplied

## Sheet LAUNCHPAD.SchDoc
size 558 x 431 mm; Engineer: Nicholas Oborny; Revision: A.1; Name: Nicholas Oborny; Start Date: 7/23/2012
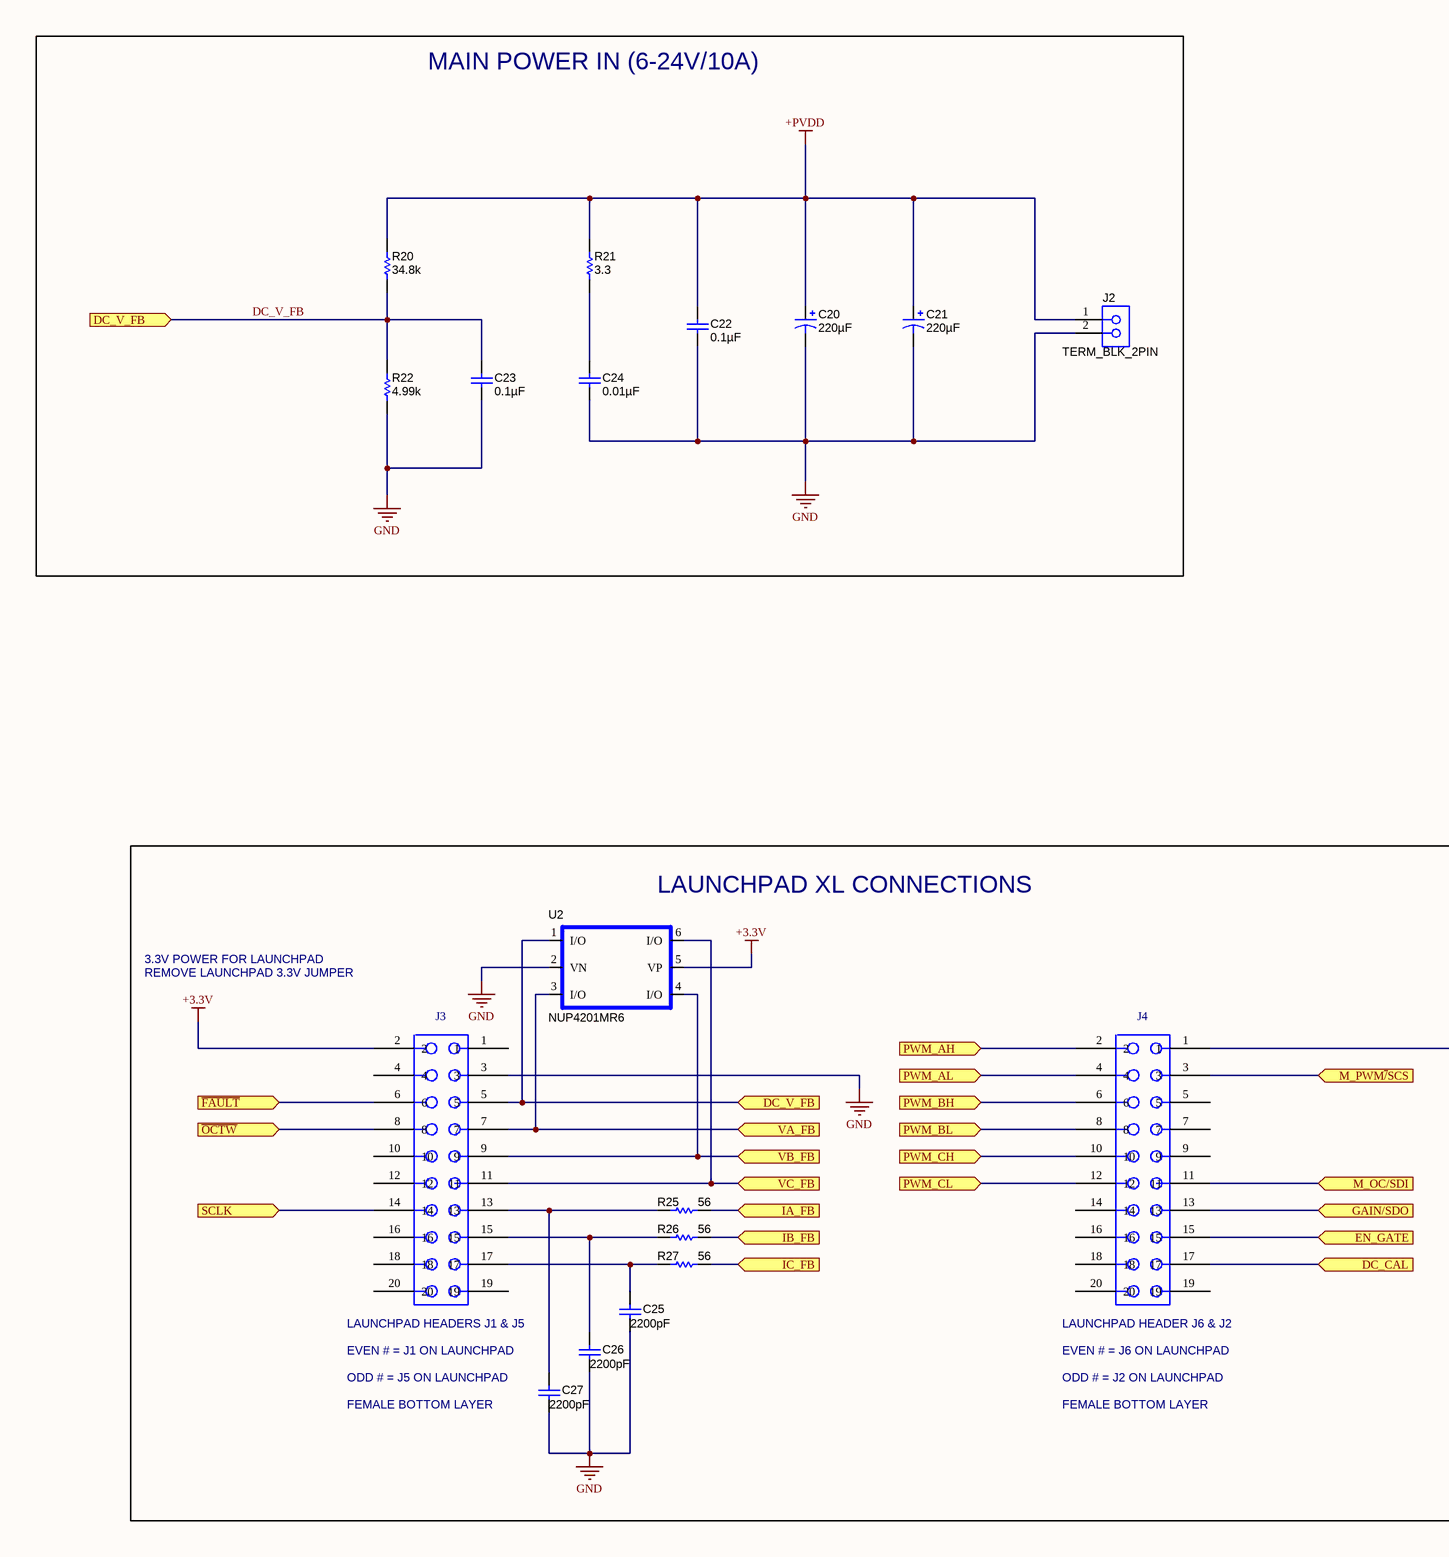
[diagram p4: LAUNCHPAD.SchDoc, left]
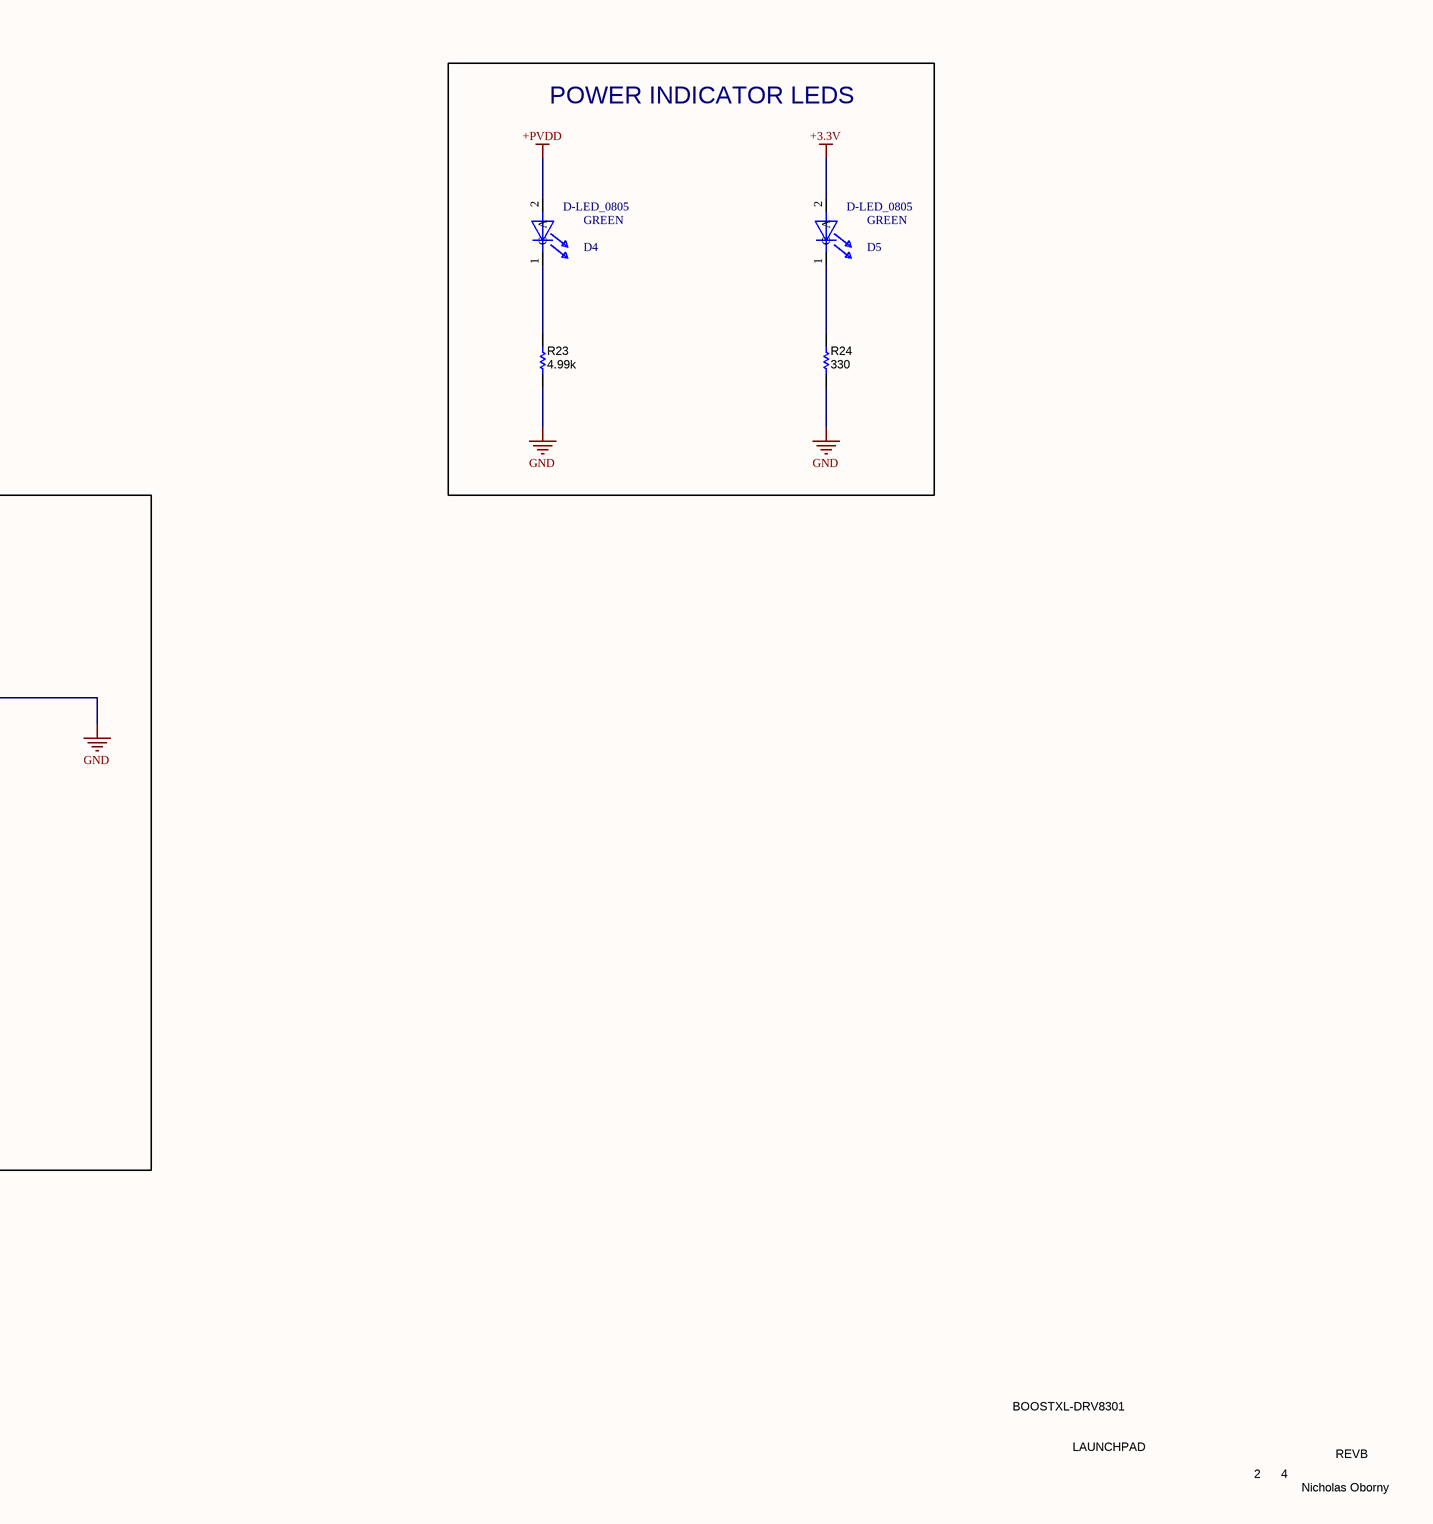
[diagram p5: LAUNCHPAD.SchDoc, right]

### Parts
C20  ValueDisplayed: 220µF  [SM_RADIAL_G]  (hidden comment: EEE-FC1H221P)
C21  ValueDisplayed: 220µF  [SM_RADIAL_G]  (hidden comment: EEE-FC1H221P)
C22  ValueDisplayed: 0.1µF  [0603L]  (hidden comment: GRM188R72A104KA35D)
C23  ValueDisplayed: 0.1µF  [0603L]  (hidden comment: C0603C104J4RACTU)
C24  ValueDisplayed: 0.01µF  [0603L]  (hidden comment: C1608X7R2A103K)
C25  ValueDisplayed: 2200pF  [0603L]  (hidden comment: GRM188R71C222KA01D)
C26  ValueDisplayed: 2200pF  [0603L]  (hidden comment: GRM188R71C222KA01D)
C27  ValueDisplayed: 2200pF  [0603L]  (hidden comment: GRM188R71C222KA01D)
D4  D-LED_0805  value GREEN  [LED_0805]
D5  D-LED_0805  value GREEN  [LED_0805]
J2  TERM_BLK_2PIN  [CONN_ED120-2DS]
J3  HEADER_NPTC202KFM  (value not drawn)
J4  HEADER_NPTC202KFM  (value not drawn)
R20  value 34.8k  [0603L]  (hidden comment: CRCW060334K8FKEA)
R21  value 3.3  [1206L]  (hidden comment: CRCW12063R30JNEA)
R22  value 4.99k  [0603L]  (hidden comment: CRCW06034K99FKEA)
R23  value 4.99k  [0603L]  (hidden comment: CRCW06034K99FKEA)
R24  value 330  [0603L]  (hidden comment: CRCW0603330RJNEA)
R25  value 56  [0603L]  (hidden comment: CRCW060356R0JNEA)
R26  value 56  [0603L]  (hidden comment: CRCW060356R0JNEA)
R27  value 56  [0603L]  (hidden comment: CRCW060356R0JNEA)
U2  NUP4201MR6  [SOT23-6]

### Blocks framed on the sheet
MAIN POWER IN (6-24V/10A): C20-C24 J2 R20-R22
POWER INDICATOR LEDS: D4 D5 R23 R24
LAUNCHPAD XL CONNECTIONS: C25-C27 J3 J4 R25-R27 U2

### Ports
DC_CAL, DC_V_FB, EN_GATE, GAIN/SDO, IA_FB, IB_FB, IC_FB, M_OC/SDI, M_PWM~{/}SCS, PWM_AH, PWM_AL, PWM_BH, PWM_BL, PWM_CH, PWM_CL, SCLK, VA_FB, VB_FB, VC_FB, ~{FAULT}, ~{OCTW}

### Nets
+3.3V: D5.2(A) J3.2 U2.5(VP)
+PVDD: C20.1(+) C21.1(+) C22.1 D4.2(A) J2.1 R20.2 R21.2
GND: C20.2(-) C21.2(-) C22.2 C23.2 C24.2 C25.2 C26.2 C27.2 J2.2 J3.3 J4.1 R22.1 R23.1 R24.1 U2.2(VN)
~{FAULT}: J3.6 ; port ~{FAULT}
~{OCTW}: J3.8 ; port ~{OCTW}
DC_CAL: J4.17 ; port DC_CAL
DC_V_FB: C23.1 J3.5 R20.1 R22.2 U2.1(I/O) ; port DC_V_FB
EN_GATE: J4.15 ; port EN_GATE
GAIN/SDO: J4.13 ; port GAIN/SDO
IA_FB: R25.2 ; port IA_FB
IB_FB: R26.2 ; port IB_FB
M_OC/SDI: J4.11 ; port M_OC/SDI
M_PWM~{/}SCS: J4.3 ; port M_PWM~{/}SCS
PWM_AH: J4.2 ; port PWM_AH
PWM_AL: J4.4 ; port PWM_AL
PWM_BH: J4.6 ; port PWM_BH
PWM_BL: J4.8 ; port PWM_BL
PWM_CH: J4.10 ; port PWM_CH
PWM_CL: J4.12 ; port PWM_CL
VA_FB: J3.7 U2.3(I/O) ; port VA_FB
VB_FB: J3.9 U2.4(I/O) ; port VB_FB
VC_FB: J3.11 U2.6(I/O) ; port VC_FB
NetC24_1: C24.1 R21.1
NetC25_1: C25.1 J3.17 R27.1
NetC26_1: C26.1 J3.15 R26.1
NetC27_1: C27.1 J3.13 R25.1
NetD4_1: D4.1(C) R23.2
NetD5_1: D5.1(C) R24.2
NetJ3_14: J3.14 ; port SCLK
NetR27_2: R27.2 ; port IC_FB

Not connected (* = marked no-connect by the designer): J3 1 4 10 12 16 18 19 20; J4 5 7 9 14 16 18 19 20

### Notes on the sheet
- 3.3V POWER FOR LAUNCHPAD
- REMOVE LAUNCHPAD 3.3V JUMPER
- (near J3) LAUNCHPAD HEADERS J1 & J5
- EVEN # = J1 ON LAUNCHPAD
- (near J4) LAUNCHPAD HEADER J6 & J2
- EVEN # = J6 ON LAUNCHPAD
- ODD # = J5 ON LAUNCHPAD
- FEMALE BOTTOM LAYER
- ODD # = J2 ON LAUNCHPAD
- BOOSTXL-DRV8301
- LAUNCHPAD
- 2
- 4
- REVB
- Nicholas Oborny

### Library data of the parts
C20 C21 = EEE-FC1H221P: CAP, AL, 220uF, 50V, +/-20%, 0.3 ohm, SMD; Manufacturer: Panasonic; Polarized: Y; CompType: Capacitor; U/M: EA; Cap_F: 0.00022; Tolerance_%: 20; Value1: 0.3 ohm; VDC_V: 50; ESR_Ohm: 0.3; IRMS_A: 0.5; TaMin_C: -40; TaMax_C: 105; Cap_Case: G; SymbolVersion: 2008-07-09; Value: 220uF; PartNumber: EEE-FC1H221P; PackageReference: SMT Radial G; RoHS: Y; Value2: 50V; MountType: SMT; Technology: AL; Series: FC; Publisher: Texas Instruments; LatestRevisionDate: 2013-05-31; ComponentLink1Description: Datasheet link; ComponentLink1URL: http://www.panasonic.com/industrial/components/pdf/smt_aec_050505.pdf; Supplier 1: Digi-Key; Supplier Part Number 1: PCE4016CT-ND; Supplier 2: Mouser; Supplier Part Number 2: 667-EEE-FC1H221P; Supplier 3: Farnell; Supplier Part Number 3: 9694579
C22 = GRM188R72A104KA35D: as C2 on sheet DRV8301; SymbolVersion: 2008-07-09; Value: 0.1uF; PartNumber: GRM188R72A104KA35D; PackageReference: 0603; RoHS: Y; Value2: 100V; MountType: SMT; Technology: Ceramic; TempCo: X7R; Published: 2008-06-19; Publisher: Texas Instruments; LatestRevisionDate: 2013-05-24; LatestRevisionNote: Changed publisher; ComponentLink1Description: Datasheet link; ComponentLink1URL: http://search.murata.co.jp/Ceramy/PnsearchViewAction.do?HnOFG=ON&HnNFG=ON&SEL_CNT=50&sLang=en&sKey=GRM188R72A104KA35D&x=9&y=9&search=startwith; Supplier 1: Digi-Key; Supplier Part Number 1: 490-3285-1-ND; Supplier 2: Mouser; Supplier Part Number 2: 81-GRM188R72A104KA35; Supplier 3: Farnell; Supplier Part Number 3: 1828921
C23 = C0603C104J4RACTU: CAP, CERM, 0.1uF, 16V, +/-5%, X7R, 0603; Manufacturer: Kemet; Polarized: N; CompType: Capacitor; U/M: EA; Cap_F: 0.0000001; Tolerance_%: 5; Value1: Unknown; VDC_V: 16; TaMin_C: -55; TaMax_C: 125; Cap_Case: 0603; SymbolVersion: 2008-07-09; Value: 0.1uF; PartNumber: C0603C104J4RACTU; PackageReference: 0603; RoHS: Y; Value2: 16V; MountType: SMT; Technology: Ceramic; TempCo: X7R; Published: 2008-06-19; Publisher: Texas Instruments; LatestRevisionDate: 2013-05-24; LatestRevisionNote: Changed publisher; ComponentLink1Description: Datasheet link; ComponentLink1URL: http://www.kemet.com/kemet/web/homepage/kechome.nsf/vapubfiles/F3102_Y5V.pdf/$file/F3102_Y5V.pdf; Supplier 1: Digi-Key; Supplier Part Number 1: 399-1097-1-ND; Supplier 2: Mouser; Supplier Part Number 2: 80-C0603C104J4R; Supplier 3: Farnell; Supplier Part Number 3: 1650834
C24 = C1608X7R2A103K: CAP, CERM, 0.01uF, 100V, +/-10%, X7R, 0603; Manufacturer: TDK; Polarized: N; CompType: Capacitor; U/M: EA; Cap_F: 0.00000001; Tolerance_%: 10; ESR_Ohm: 0.0661; Value1: 0.0661 ohm; VDC_V: 100; TaMin_C: -55; TaMax_C: 125; Cap_Case: 0603; SymbolVersion: 2008-07-09; Value: 0.01uF; PartNumber: C1608X7R2A103K; PackageReference: 0603; RoHS: Y; Value2: 100V; MountType: SMT; Technology: Ceramic; TempCo: X7R; Published: 2008-06-19; Publisher: Texas Instruments; LatestRevisionDate: 2013-05-24; LatestRevisionNote: Changed publisher; ComponentLink1Description: Datasheet link; ComponentLink1URL: http://www.tdk.co.jp/tefe02/e412_c.pdf; Supplier 1: Digi-Key; Supplier Part Number 1: 445-1304-1-ND; Supplier 2: Farnell; Supplier Part Number 2: 1907322
C25-C27 = GRM188R71C222KA01D: CAP, CERM, 2200pF, 16V, +/-10%, X7R, 0603; Manufacturer: MuRata; Polarized: N; CompType: Capacitor; U/M: EA; Cap_F: 0.0000000022; Tolerance_%: 10; Value1: Unknown; VDC_V: 16; TaMin_C: -55; TaMax_C: 125; Cap_Case: 0603; SymbolVersion: 2008-07-09; Value: 2200pF; PartNumber: GRM188R71C222KA01D; PackageReference: 0603; RoHS: Y; Value2: 16V; MountType: SMT; Technology: Ceramic; TempCo: X7R; Published: 2008-06-19; Publisher: Texas Instruments; LatestRevisionDate: 2013-05-24; LatestRevisionNote: Changed publisher; ComponentLink1Description: Datasheet link; ComponentLink1URL: http://search.murata.co.jp/Ceramy/PnsearchViewAction.do?HnOFG=ON&HnNFG=ON&SEL_CNT=50&sLang=en&sKey=GRM188R71C222KA01D&x=9&y=9&search=startwith; Supplier 1: Digi-Key; Supplier Part Number 1: GRM188R71C222KA01D-ND; Supplier 2: Mouser; Supplier Part Number 2: 81-GRM188R71C222KA1D
D4 = D-LED_0805: LED THIN 565NM GRN DIFF 0805 SMD; PartNumber: SML-LXT0805GW-TR; Manufacturer: Lumex Opto/Components Inc; Vendor Part #: 67-1553-1-ND; Area: 2.5 mm; Vendor: DigiKey; ModifyDate: 10/26/2011 10:26:35; PCB DECAL: LED-0805; ComponentHeight: 0.8 mm; Size: 805
D5 = D-LED_0805: LED THIN 565NM GRN DIFF 0805 SMD; PartNumber: SML-LXT0805GW-TR; Manufacturer: Lumex Opto/Components Inc; Vendor Part #: 67-1553-1-ND; PCB DECAL: LED-0805C; Area: 2.5 mm; Vendor: DigiKey; ModifyDate: 10/26/2011 10:26:35; ComponentHeight: 0.8mm; Size: 805
J2 = ED120/2DS: TERMINAL BLOCK 5.08MM VERT 2POS; PartNumber: OSTTA024163; Manufacturer: On-Shore Technology; U/M: EA; Value: 2 Pin Header; SymbolVersion: 2010-10-20; CompType: Terminal Block; RoHS: Y; PackageReference: TERM_BLK, 2pos, 5.08mm; MountType: TH; Publisher: Texas Instruments; LatestRevisionDate: 2013-06-04; Supplier 1: Digi-Key; Supplier Part Number 1: ED2580-ND
J3 J4 = HEADER_NPTC202KFM: CONN RCPT 20POS .100 DL STR SMD; PartNumber: 89898-310ALF; Manufacturer: FCI; Vendor Part #: 609-4473-1-ND; Second Source: C:\program files\p-cad 2004\HEADER_NPTC-SERIES.pdf; Reference: \\vette02\pmp_pcb\pcad_pdf's\HEADER_NPTC-SERIES.pdf; Area: 363000; Value: 20-Pin/2-Row; Vendor: DigiKey; ModifyDate: 07/24/2012 09:28:03; Size: 0.270X1.020; ComponentHeight: 0.30mil; PCB DECAL: HEADER_NPTC202KFM
R20 = CRCW060334K8FKEA: RES, 34.8k ohm, 1%, 0.1W, 0603; Manufacturer: Vishay-Dale; CompType: Resistor; Res_ohm: 34800; Value_Code: 34k8; Tolerance_%: 1; Power_W: 0.1; VDC_V: 75; TempCo: 100 ppm/C; EIA_Code: E96; U/M: EA; SymbolVersion: 2009-05-29; PartNumber: CRCW060334K8FKEA; PackageReference: 0603; RoHS: Y; Value1: 1%; Value2: 0.1W; MountType: SMT; Technology: Thick Film; Published: 2008-06-26; Publisher: Texas Instruments; LatestRevisionDate: 2013-01-08; ComponentLink1Description: Datasheet link; ComponentLink1URL: http://www.vishay.com/docs/20035/dcrcwe3.pdf; Supplier 1: Digi-Key; Supplier Part Number 1: 541-34.8KHCT-ND; Supplier 2: Mouser; Supplier Part Number 2: 71-CRCW0603-34.8K-E3; Supplier 3: Farnell; Supplier Part Number 3: 1151951
R21 = CRCW12063R30JNEA: RES, 3.3 ohm, 5%, 0.25W, 1206; Manufacturer: Vishay-Dale; CompType: Resistor; Value_Code: 3R30; Tolerance_%: 5; Power_W: 0.25; VDC_V: 200; TempCo: 200 ppm/C; EIA_Code: E24; U/M: EA; SymbolVersion: 2009-05-29; PartNumber: CRCW12063R30JNEA; PackageReference: 1206; RoHS: Y; Res_ohm: 3.3; Value1: 5%; Value2: 0.25W; MountType: SMT; Technology: Thick Film; Published: 2008-06-26; Publisher: Texas Instruments; LatestRevisionDate: 2013-01-18; ComponentLink1Description: Datasheet link; ComponentLink1URL: http://www.vishay.com/docs/20035/dcrcwe3.pdf; Supplier 1: Digi-Key; Supplier Part Number 1: 541-3.3ECT-ND; Supplier 2: Mouser; Supplier Part Number 2: 71-CRCW1206J-3.3-E3; Supplier 3: Farnell; Supplier Part Number 3: 1540015
R22 R23 = CRCW06034K99FKEA: RES, 4.99k ohm, 1%, 0.1W, 0603; Manufacturer: Vishay-Dale; CompType: Resistor; Res_ohm: 4990; Value_Code: 4k99; Tolerance_%: 1; Power_W: 0.1; VDC_V: 75; TempCo: 100 ppm/C; EIA_Code: E96; U/M: EA; SymbolVersion: 2009-05-29; PartNumber: CRCW06034K99FKEA; PackageReference: 0603; RoHS: Y; Value1: 1%; Value2: 0.1W; MountType: SMT; Technology: Thick Film; Published: 2008-06-26; Publisher: Texas Instruments; LatestRevisionDate: 2013-01-08; ComponentLink1Description: Datasheet link; ComponentLink1URL: http://www.vishay.com/docs/20035/dcrcwe3.pdf; Supplier 1: Digi-Key; Supplier Part Number 1: 541-4.99KHCT-ND; Supplier 2: Mouser; Supplier Part Number 2: 71-CRCW0603-4.99K-E3; Supplier 3: Farnell; Supplier Part Number 3: 1652885
R24 = CRCW0603330RJNEA: as R1 on sheet DRV8301; SymbolVersion: 2009-05-29; PartNumber: CRCW0603330RJNEA; PackageReference: 0603; RoHS: Y; Res_ohm: 330; Value1: 5%; Value2: 0.1W; MountType: SMT; Technology: Thick Film; Published: 2008-06-26; Publisher: Texas Instruments; LatestRevisionDate: 2013-01-08; ComponentLink1Description: Datasheet link; ComponentLink1URL: http://www.vishay.com/docs/20035/dcrcwe3.pdf; Supplier 1: Digi-Key; Supplier Part Number 1: 541-330GCT-ND; Supplier 2: Mouser; Supplier Part Number 2: 71-CRCW0603J-330-E3; Supplier 3: Farnell; Supplier Part Number 3: 1692522
R25-R27 = CRCW060356R0JNEA: RES, 56 ohm, 5%, 0.1W, 0603; Manufacturer: Vishay-Dale; CompType: Resistor; Value_Code: 56R0; Tolerance_%: 5; Power_W: 0.1; VDC_V: 75; TempCo: 200 ppm/C; EIA_Code: E24; U/M: EA; SymbolVersion: 2009-05-29; PartNumber: CRCW060356R0JNEA; PackageReference: 0603; RoHS: Y; Res_ohm: 56; Value1: 5%; Value2: 0.1W; MountType: SMT; Technology: Thick Film; Published: 2008-06-26; Publisher: Texas Instruments; LatestRevisionDate: 2013-01-08; ComponentLink1Description: Datasheet link; ComponentLink1URL: http://www.vishay.com/docs/20035/dcrcwe3.pdf; Supplier 1: Digi-Key; Supplier Part Number 1: 541-56GCT-ND; Supplier 2: Mouser; Supplier Part Number 2: 71-CRCW0603J-56-E3; Supplier 3: Farnell; Supplier Part Number 3: 1514781
U2 = NUP4201MR6: IC,  500w 6v, Transient Voltage  Suppressors; Manufacturer: On Semi; Area: 20.1 mm; ComponentHeight: 1 mm; SymbolVersion: 04/10/2012 10:34:18; PartNumber: NUP4201MR6; ComponentLink1URL: \\vette02\pmp_pcb\pcad_pdf's\NUP4201MR6-D.pdf; PackageReference: SOT; Value: NUP4201MR6; ComponentLink1Description: AEO Datasheet Link

## Sheet MOTOR.SchDoc
size 558 x 431 mm; Engineer: Nicholas Oborny; Revision: A.1; Name: Nicholas Oborny; Start Date: 7/23/2012
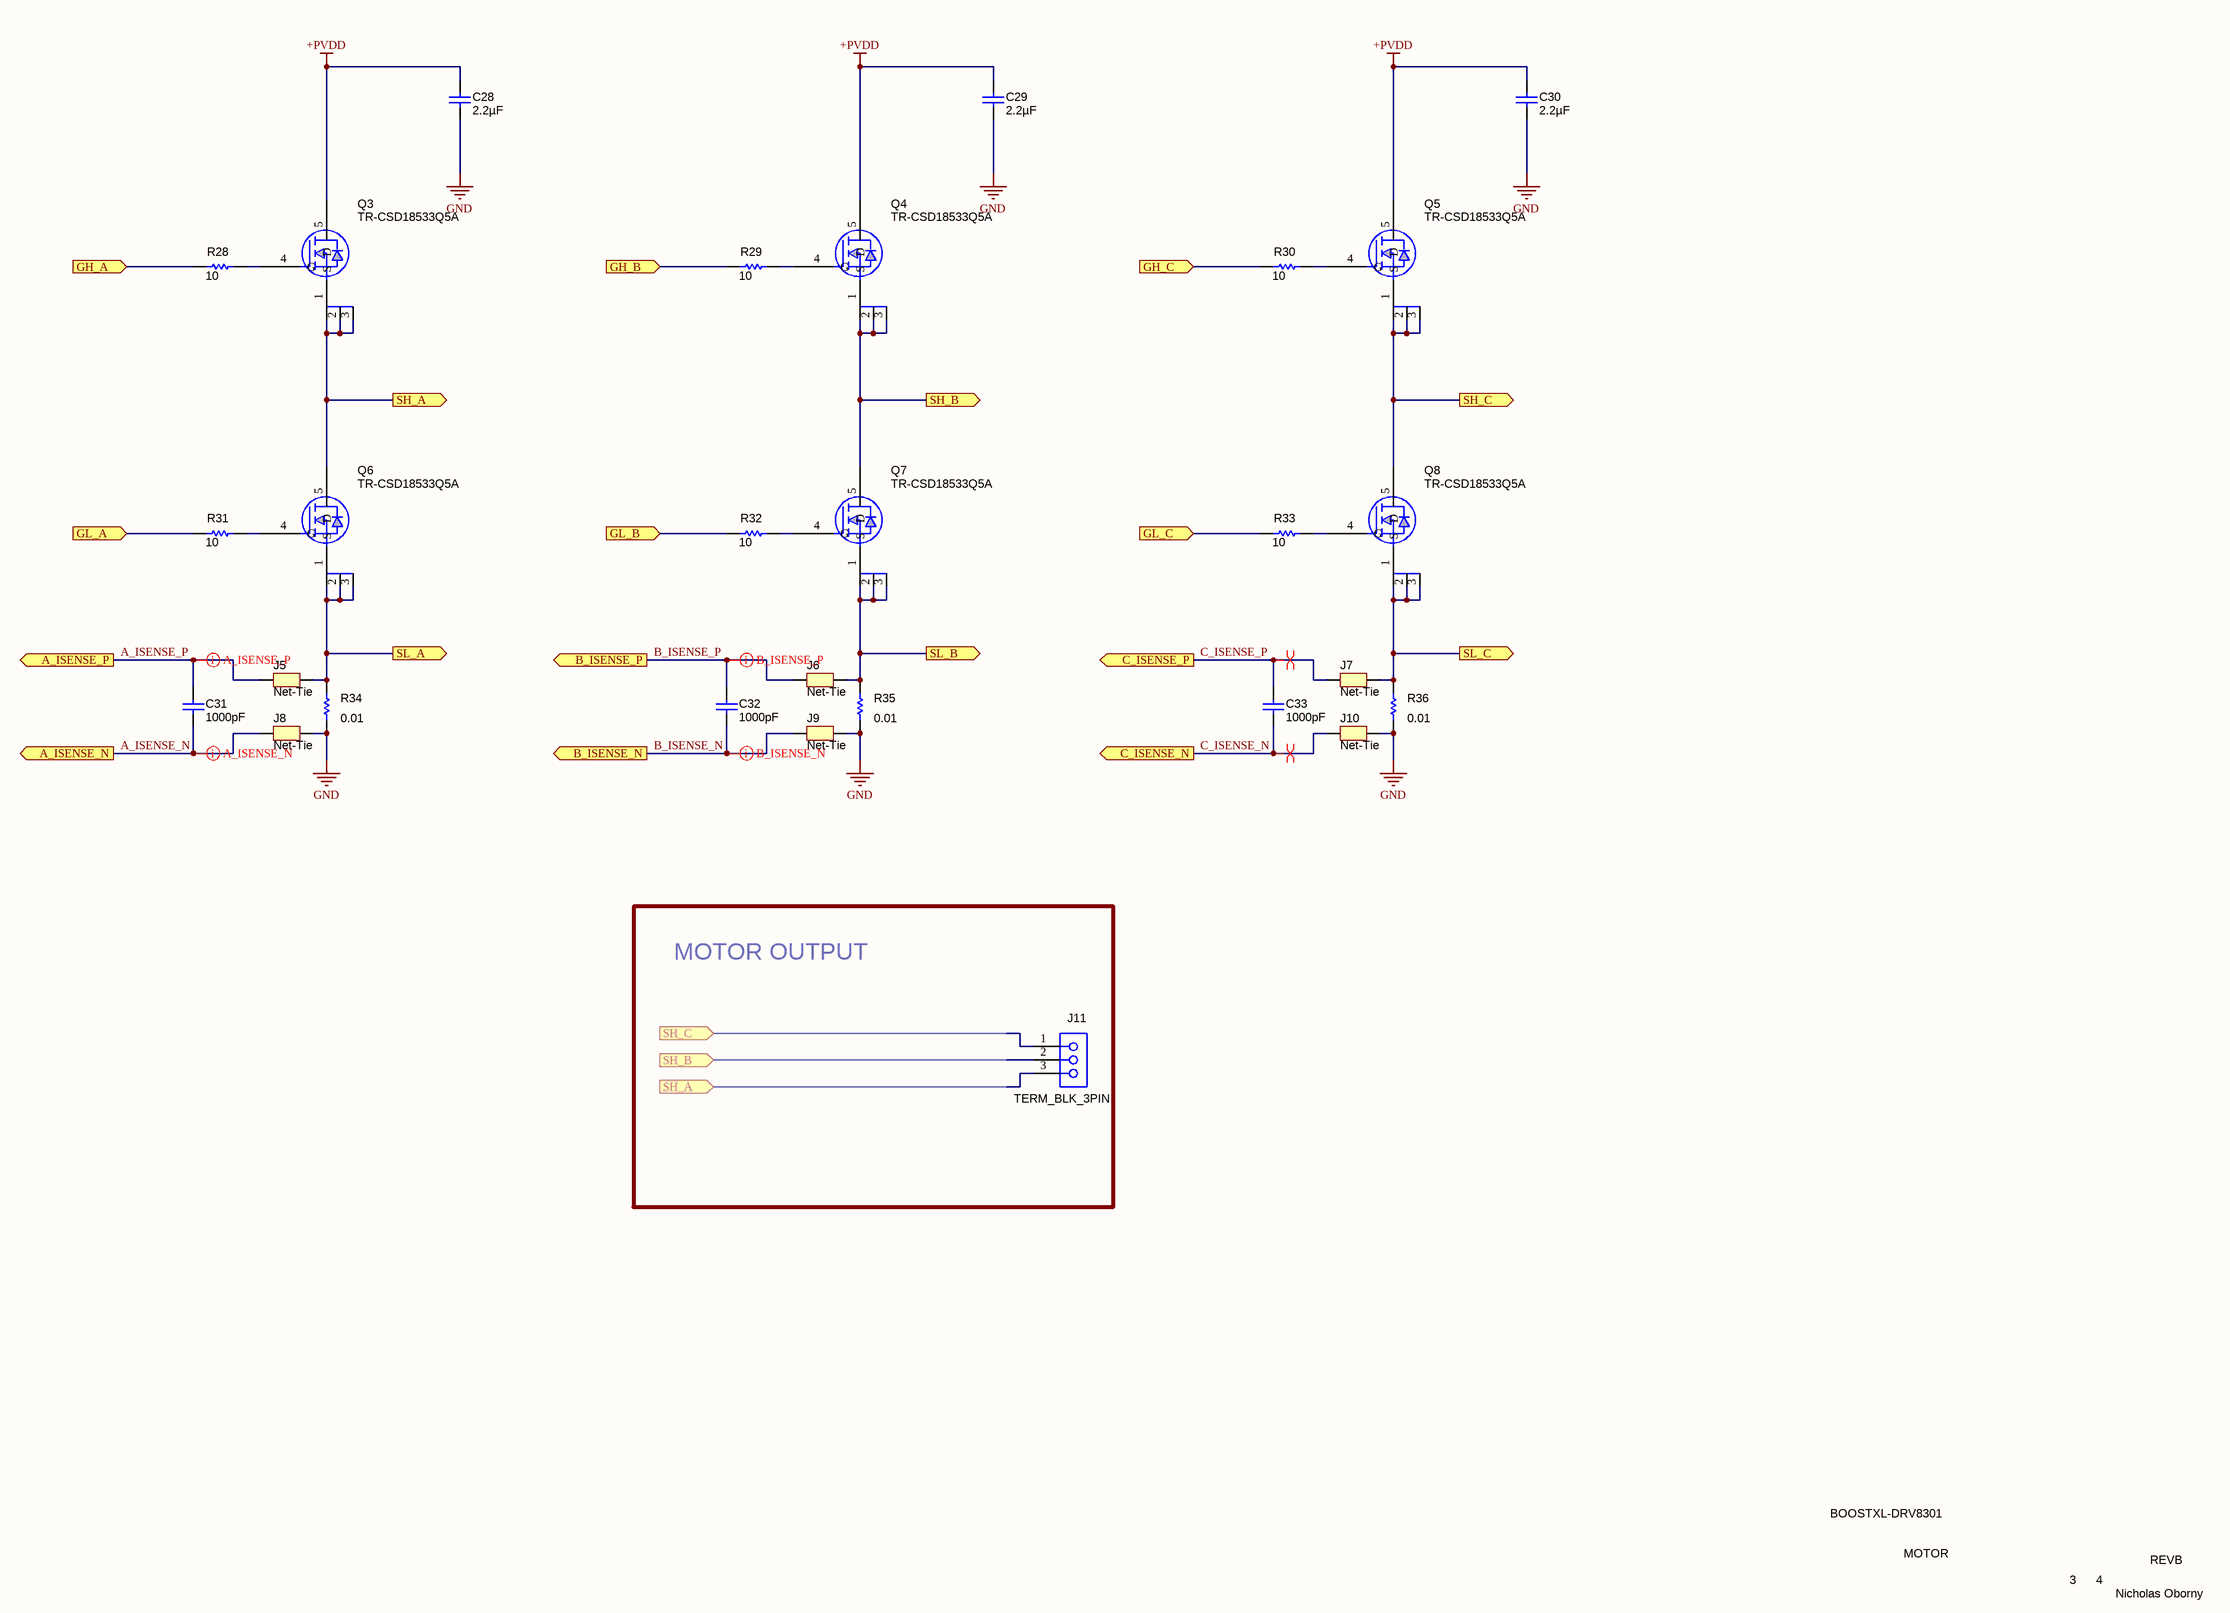
[diagram p6: MOTOR.SchDoc]

### Parts
C28  ValueDisplayed: 2.2µF  [1210L]  (hidden comment: GRM32ER72A225KA35L)
C29  ValueDisplayed: 2.2µF  [1210L]  (hidden comment: GRM32ER72A225KA35L)
C30  ValueDisplayed: 2.2µF  [1210L]  (hidden comment: GRM32ER72A225KA35L)
C31  ValueDisplayed: 1000pF  [0603]  (hidden comment: C0603C102J5GAC)
C32  ValueDisplayed: 1000pF  [0603]  (hidden comment: C0603C102J5GAC)
C33  ValueDisplayed: 1000pF  [0603]  (hidden comment: C0603C102J5GAC)
J5  Net-Tie  [Net-Tie_10mil]  (net tie, no BOM)
J6  Net-Tie  [Net-Tie_10mil]  (net tie, no BOM)
J7  Net-Tie  [Net-Tie_10mil]  (net tie, no BOM)
J8  Net-Tie  [Net-Tie_10mil]  (net tie, no BOM)
J9  Net-Tie  [Net-Tie_10mil]  (net tie, no BOM)
J10  Net-Tie  [Net-Tie_10mil]  (net tie, no BOM)
J11  TERM_BLK_3PIN  [CONN_ED120_3DS]
Q3  TR-CSD18533Q5A  [QFN5X6MM]
Q4  TR-CSD18533Q5A  [QFN5X6MM]
Q5  TR-CSD18533Q5A  [QFN5X6MM]
Q6  TR-CSD18533Q5A  [QFN5X6MM]
Q7  TR-CSD18533Q5A  [QFN5X6MM]
Q8  TR-CSD18533Q5A  [QFN5X6MM]
R28  value 10  [0603L]  (hidden comment: CRCW060310R0JNEA)
R29  value 10  [0603L]  (hidden comment: CRCW060310R0JNEA)
R30  value 10  [0603L]  (hidden comment: CRCW060310R0JNEA)
R31  value 10  [0603L]  (hidden comment: CRCW060310R0JNEA)
R32  value 10  [0603L]  (hidden comment: CRCW060310R0JNEA)
R33  value 10  [0603L]  (hidden comment: CRCW060310R0JNEA)
R34  value 0.01  [2512M]  (hidden comment: CRA2512-FZ-R010ELF)
R35  value 0.01  [2512M]  (hidden comment: CRA2512-FZ-R010ELF)
R36  value 0.01  [2512M]  (hidden comment: CRA2512-FZ-R010ELF)

### Blocks framed on the sheet
MOTOR OUTPUT: J11

### Ports
A_ISENSE_N, A_ISENSE_P, B_ISENSE_N, B_ISENSE_P, C_ISENSE_N, C_ISENSE_P, GH_A, GH_B, GH_C, GL_A, GL_B, GL_C, SH_A, SH_B, SH_C, SL_A, SL_B, SL_C

### Nets
+PVDD: C28.1 C29.1 C30.1 Q3.5(D) Q4.5(D) Q5.5(D)
GND: C28.2 C29.2 C30.2 J8.1 J9.1 J10.1 R34.1 R35.1 R36.1
A_ISENSE_N: C31.2 J8.2 ; port A_ISENSE_N
A_ISENSE_P: C31.1 J5.2 ; port A_ISENSE_P
B_ISENSE_N: C32.2 J9.2 ; port B_ISENSE_N
B_ISENSE_P: C32.1 J6.2 ; port B_ISENSE_P
C_ISENSE_N: C33.2 J10.2 ; port C_ISENSE_N
C_ISENSE_P: C33.1 J7.2 ; port C_ISENSE_P
GH_A: R28.1 ; port GH_A
GH_B: R29.1 ; port GH_B
GH_C: R30.1 ; port GH_C
GL_A: R31.1 ; port GL_A
GL_B: R32.1 ; port GL_B
GL_C: R33.1 ; port GL_C
SH_A: J11.3 Q3.1(S) Q3.2 Q3.3 Q6.5(D) ; port SH_A
SH_B: J11.2 Q4.1(S) Q4.2 Q4.3 Q7.5(D) ; port SH_B
SH_C: J11.1 Q5.1(S) Q5.2 Q5.3 Q8.5(D) ; port SH_C
SL_A: J5.1 Q6.1(S) Q6.2 Q6.3 R34.2 ; port SL_A
SL_B: J6.1 Q7.1(S) Q7.2 Q7.3 R35.2 ; port SL_B
SL_C: J7.1 Q8.1(S) Q8.2 Q8.3 R36.2 ; port SL_C
NetQ3_4: Q3.4(G) R28.2
NetQ4_4: Q4.4(G) R29.2
NetQ5_4: Q5.4(G) R30.2
NetQ6_4: Q6.4(G) R31.2
NetQ7_4: Q7.4(G) R32.2
NetQ8_4: Q8.4(G) R33.2

### Layout directives
differential pair: A_ISENSE_N, A_ISENSE_P, B_ISENSE_N, B_ISENSE_P, C_ISENSE_N, C_ISENSE_P

### Notes on the sheet
- BOOSTXL-DRV8301
- MOTOR
- 3
- 4
- REVB
- Nicholas Oborny

### Library data of the parts
C28-C30 = GRM32ER72A225KA35L: as C1 on sheet DRV8301; SymbolVersion: 2008-07-09; Value: 2.2uF; PartNumber: GRM32ER72A225KA35L; PackageReference: 1210; RoHS: Y; Value2: 100V; MountType: SMT; Technology: Ceramic; TempCo: X7R; Published: 2008-06-19; Publisher: Texas Instruments; LatestRevisionDate: 2013-05-24; LatestRevisionNote: Changed publisher; ComponentLink1Description: Datasheet link; ComponentLink1URL: http://search.murata.co.jp/Ceramy/PnsearchViewAction.do?HnOFG=ON&HnNFG=ON&SEL_CNT=50&sLang=en&sKey=GRM32ER72A225KA35L&x=9&y=9&search=startwith; Supplier 1: Digi-Key; Supplier Part Number 1: 490-3385-1-ND; Supplier 2: Mouser; Supplier Part Number 2: 81-GRM32ER72A225KA35; Supplier 3: Farnell; Supplier Part Number 3: 1735547
C31-C33 = C0603C102J5GAC: CAP, CERM, 1000pF, 50V, +/-5%, C0G/NP0, 0603; Manufacturer: Kemet; Polarized: N; CompType: Capacitor; U/M: EA; Cap_F: 0.000000001; Tolerance_%: 5; Value1: Unknown; VDC_V: 50; TaMin_C: -55; TaMax_C: 125; SymbolVersion: 2008-07-09; Value: 1000pF; PartNumber: C0603C102J5GAC; PackageReference: 0603; RoHS: Y; Value2: 50V; MountType: SMT; Technology: Ceramic; TempCo: C0G/NP0; Cap_Case: 0603; Published: 2008-06-19; Publisher: Texas Instruments; LatestRevisionDate: 2013-05-24; LatestRevisionNote: Changed publisher; ComponentLink1Description: Datasheet link; ComponentLink1URL: http://www.kemet.com/kemet/web/homepage/kechome.nsf/vapubfiles/F3102_Y5V.pdf/$file/F3102_Y5V.pdf; Supplier 1: Farnell; Supplier Part Number 1: 317202
J5-J10 = Net-Tie: Single point connection between nets.; SymbolCreator: codlsc; SymbolVersion: 2009-07-01; MountType: SMT; Publisher: Texas Instruments; LatestRevisionDate: 2013-05-15; LatestRevisionNote: Added Alternate PartNumber and Alternate Manufacturer parameters to appropriate components.
J11 = ED120/3DS: TERMINAL BLOCK 5.08MM VERT 3POS; PartNumber: OSTTA034163; Manufacturer: On-Shore Technology; SymbolCreator: a0412235; U/M: EA; Value: 3 Pin Header; SymbolVersion: 2013-02-28; CompType: Terminal Block; RoHS: Y; PackageReference: TERM_BLK, 3pos, 5.08mm; MountType: TH; Publisher: Texas Instruments; LatestRevisionDate: 2013-06-04; Supplier 1: Digi-Key; Supplier Part Number 1: ED2581-ND
Q3-Q8 = TR-CSD18533Q5A: MOSFET, N-Chan, 60V, 18A, 6.1 mOhm; Manufacturer: TI; Area: 86800; SymbolVersion: 04/25/2012 11:24:36; PartNumber: CSD18533Q5A; ComponentLink1URL: \\vette02\pmp_pcb\pcad_pdf's\CSD18533Q5A.pdf; PackageReference: QFN-8 POWER; Value: CSD18533Q5A; ComponentHeight: *; ComponentLink1Description: AEO Datasheet Link
R28-R33 = CRCW060310R0JNEA: RES, 10 ohm, 5%, 0.1W, 0603; Manufacturer: Vishay-Dale; CompType: Resistor; Value_Code: 10R0; Tolerance_%: 5; Power_W: 0.1; VDC_V: 75; TempCo: 200 ppm/C; EIA_Code: E24; U/M: EA; SymbolVersion: 2009-05-29; PartNumber: CRCW060310R0JNEA; PackageReference: 0603; RoHS: Y; Res_ohm: 10; Value1: 5%; Value2: 0.1W; MountType: SMT; Technology: Thick Film; Published: 2008-06-26; Publisher: Texas Instruments; LatestRevisionDate: 2013-01-08; ComponentLink1Description: Datasheet link; ComponentLink1URL: http://www.vishay.com/docs/20035/dcrcwe3.pdf; Supplier 1: Digi-Key; Supplier Part Number 1: 541-10GCT-ND; Supplier 2: Mouser; Supplier Part Number 2: 71-CRCW0603J-10-E3; Supplier 3: Farnell; Supplier Part Number 3: 1514712
R34-R36 = CRA2512-FZ-R010ELF: RES, 0.01 ohm, 1%, 3W, 2512; Manufacturer: Bourns; CompType: Resistor; Value_Code: R010; Tolerance_%: 1; Power_W: 3; TempCo: 75 ppm/C; EIA_Code: E96; U/M: EA; SymbolVersion: 2009-05-29; PartNumber: CRA2512-FZ-R010ELF; PackageReference: 2512; RoHS: Y; Res_ohm: 0.01; Value1: 1%; Value2: 3W; MountType: SMT; Technology: Metal Film; Published: 2008-06-26; Publisher: Texas Instruments; LatestRevisionDate: 2013-05-25; ComponentLink1Description: Datasheet link; ComponentLink1URL: http://www.bourns.com/data/global/pdfs/CRA.pdf; Supplier 1: Digi-Key; Supplier Part Number 1: CRA2512-FZ-R010ELFCT-ND; Supplier 2: Mouser; Supplier Part Number 2: 652-CRA2512FZR010ELF; Supplier 3: Farnell; Supplier Part Number 3: 1435947